# EAGLE schematic eclair-logical (EAGLE 6.6.0), part 1 of 2

## Sheet 1 of 10: MAR/MDR
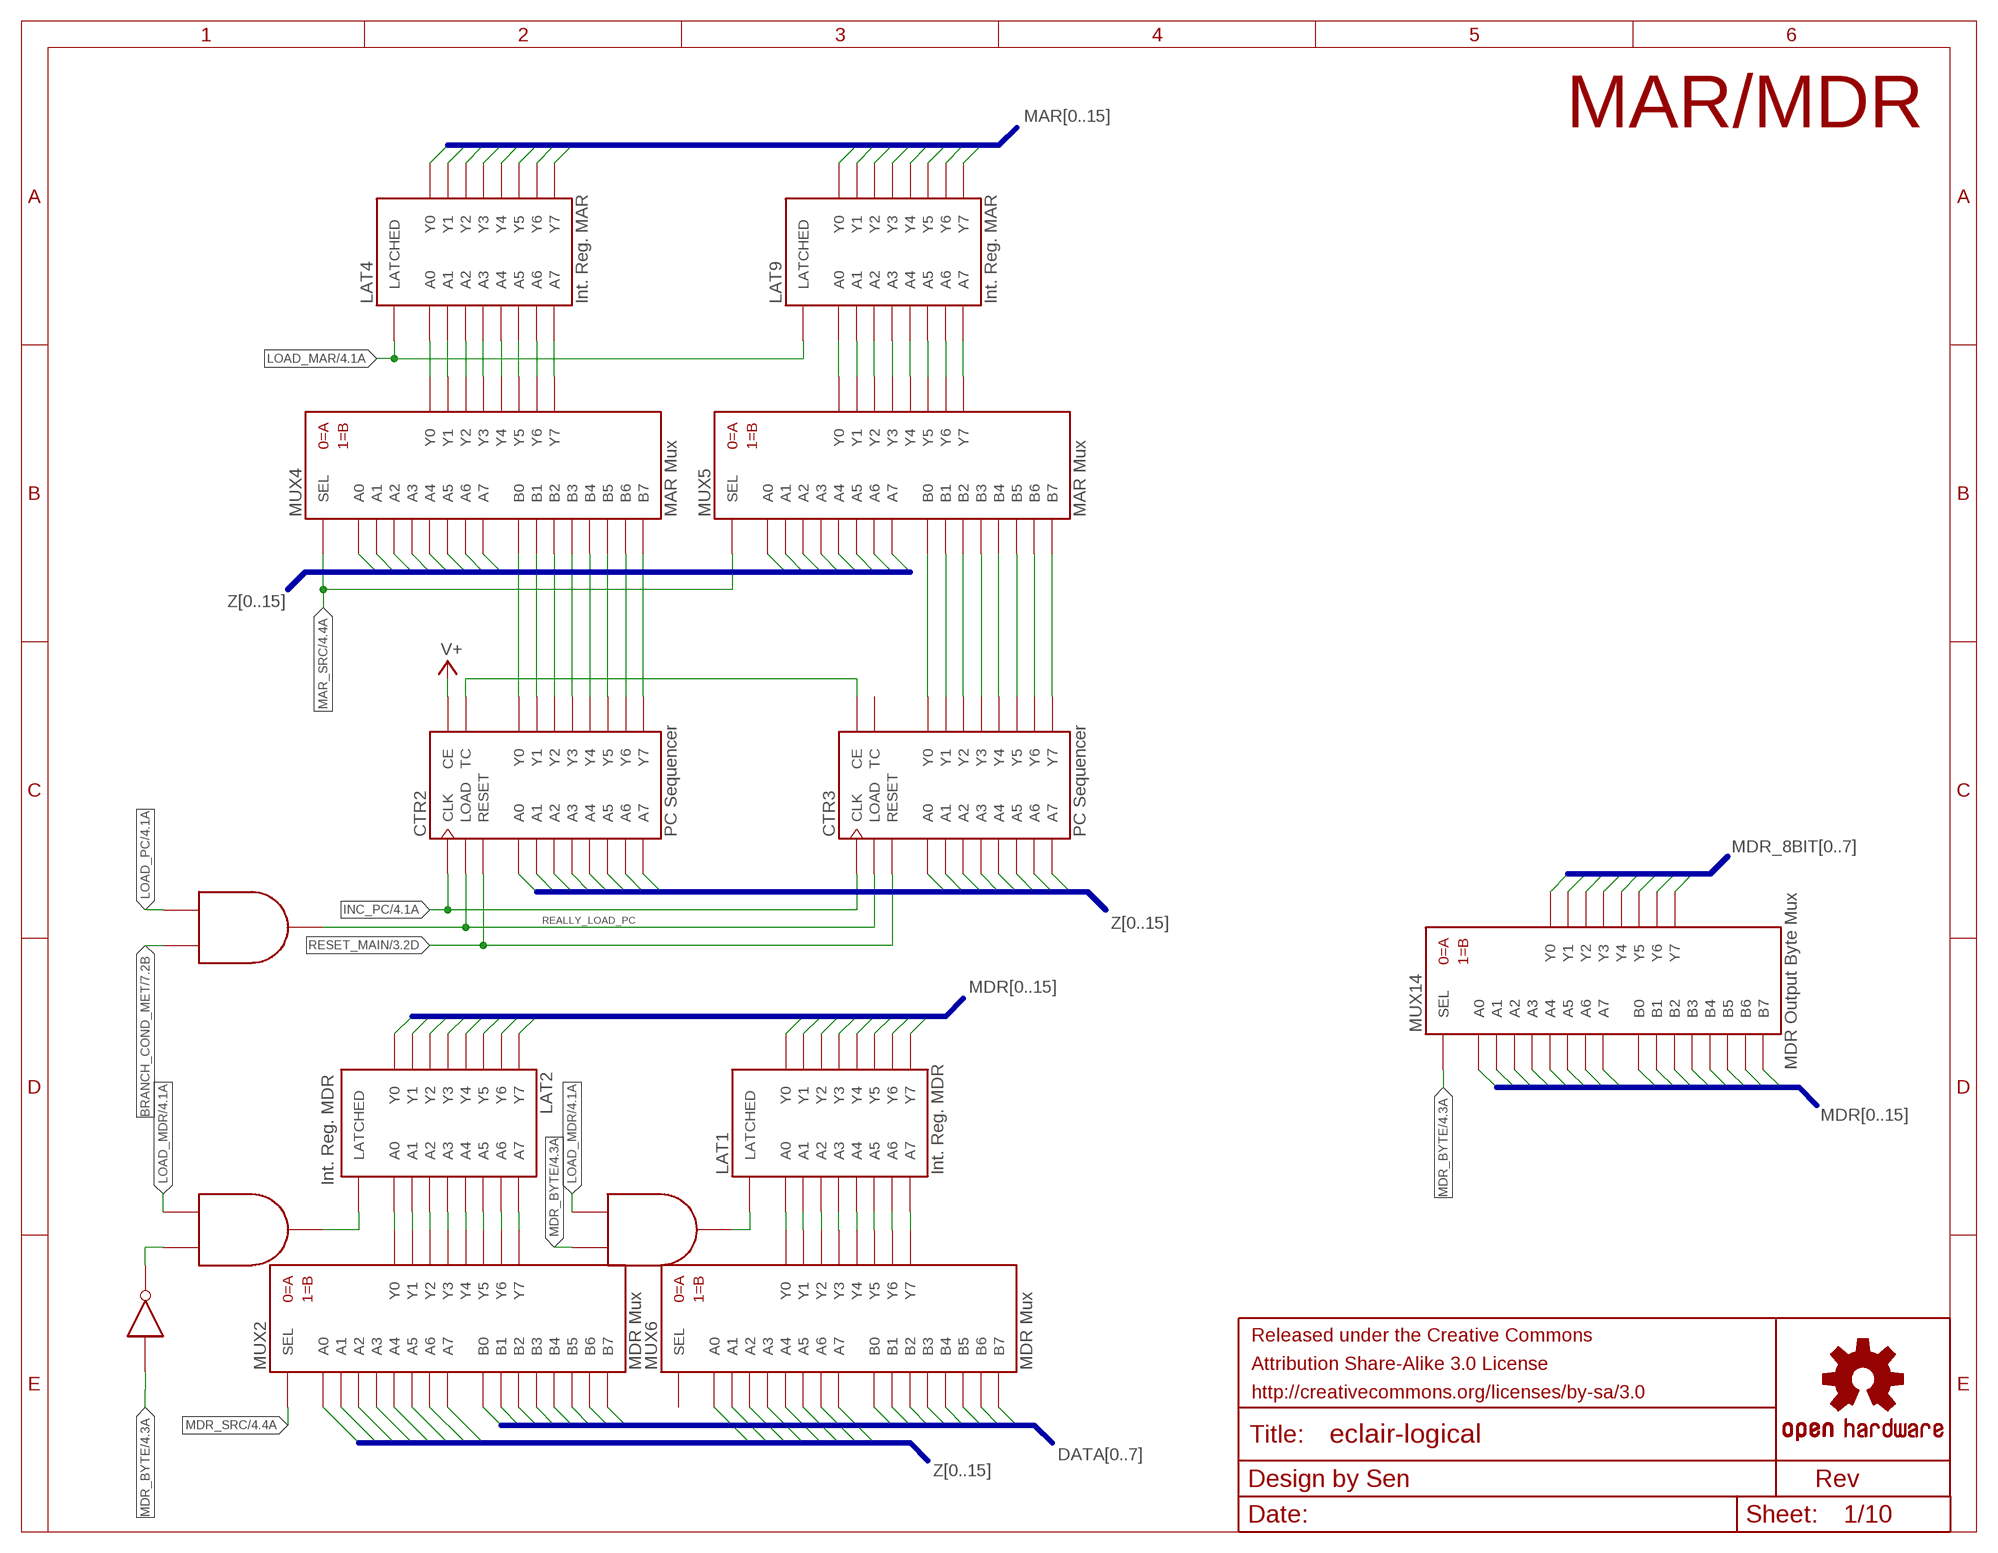
[diagram p0: schematic, sheet 1]

### Parts
AND11  AND-2  [NULL]
AND20  AND-2  [NULL]
AND21  AND-2  [NULL]
CTR2  PC Sequencer  COUNTER-8-LR  [NULL]
CTR3  PC Sequencer  COUNTER-8-LR  [NULL]
FRAME8  FRAME-LETTER-GRID-OSHW-SEN  [CC-BY-SA-3.0-LARGE]
LAT1  Int. Reg. MDR  LATCH-8  [NULL]
LAT2  Int. Reg. MDR  LATCH-8  [NULL]
LAT4  Int. Reg. MAR  LATCH-8  [NULL]
LAT9  Int. Reg. MAR  LATCH-8  [NULL]
MUX2  MDR Mux  MUX-2X8  [NULL]
MUX4  MAR Mux  MUX-2X8  [NULL]
MUX5  MAR Mux  MUX-2X8  [NULL]
MUX6  MDR Mux  MUX-2X8  [NULL]
MUX14  MDR Output Byte Mux  MUX-2X8  [NULL]
NOT3  NOT  [NULL]

### Nets
BRANCH_COND_MET: AND11.P$2(B) ; also sheet 7
DATA0: MUX2.P$9(B0) MUX6.P$9(B0) ; also sheet 5,8
DATA1: MUX2.P$10(B1) MUX6.P$10(B1) ; also sheet 5,8
DATA2: MUX2.P$11(B2) MUX6.P$11(B2) ; also sheet 5,8
DATA3: MUX2.P$12(B3) MUX6.P$12(B3) ; also sheet 5,8
DATA4: MUX2.P$13(B4) MUX6.P$13(B4) ; also sheet 5,8
DATA5: MUX2.P$14(B5) MUX6.P$14(B5) ; also sheet 5,8
DATA6: MUX2.P$15(B6) MUX6.P$15(B6) ; also sheet 5,8
DATA7: MUX2.P$16(B7) MUX6.P$16(B7) ; also sheet 5,8
INC_PC: CTR2.P$9(CLK) CTR3.P$9(CLK) ; also sheet 4
LOAD_MAR: LAT4.P$9(LATCHED) LAT9.P$9(LATCHED) ; also sheet 4
LOAD_MDR: AND20.P$1(A) AND21.P$1(A) ; also sheet 4
LOAD_MDR_H: AND21.P$3(Y) LAT1.P$9(LATCHED)
LOAD_MDR_L: AND20.P$3(Y) LAT2.P$9(LATCHED)
LOAD_PC: AND11.P$1(A) ; also sheet 4
MAR0: LAT4.P$10(Y0) ; also sheet 2,9
MAR1: LAT4.P$11(Y1) ; also sheet 2,9
MAR2: LAT4.P$12(Y2) ; also sheet 2,9
MAR3: LAT4.P$13(Y3) ; also sheet 2,9
MAR4: LAT4.P$14(Y4) ; also sheet 2
MAR5: LAT4.P$15(Y5) ; also sheet 2,9
MAR6: LAT4.P$16(Y6) ; also sheet 2,9
MAR7: LAT4.P$17(Y7) ; also sheet 2,9
MAR8: LAT9.P$10(Y0) ; also sheet 2,9
MAR9: LAT9.P$11(Y1) ; also sheet 2,9
MAR10: LAT9.P$12(Y2) ; also sheet 2,9
MAR11: LAT9.P$13(Y3) ; also sheet 2,9
MAR12: LAT9.P$14(Y4) ; also sheet 2,9
MAR13: LAT9.P$15(Y5) ; also sheet 2,9
MAR14: LAT9.P$16(Y6) ; also sheet 2,9
MAR15: LAT9.P$17(Y7) ; also sheet 2,9
MAR_SRC: MUX4.P$17(SEL) MUX5.P$17(SEL) ; also sheet 4
MDR0: LAT2.P$10(Y0) MUX14.P$1(A0) ; also sheet 2
MDR1: LAT2.P$11(Y1) MUX14.P$2(A1) ; also sheet 2
MDR2: LAT2.P$12(Y2) MUX14.P$3(A2) ; also sheet 2
MDR3: LAT2.P$13(Y3) MUX14.P$4(A3) ; also sheet 2
MDR4: LAT2.P$14(Y4) MUX14.P$5(A4) ; also sheet 2
MDR5: LAT2.P$15(Y5) MUX14.P$6(A5) ; also sheet 2
MDR6: LAT2.P$16(Y6) MUX14.P$7(A6) ; also sheet 2
MDR7: LAT2.P$17(Y7) MUX14.P$8(A7) ; also sheet 2
MDR8: LAT1.P$10(Y0) MUX14.P$9(B0) ; also sheet 2
MDR9: LAT1.P$11(Y1) MUX14.P$10(B1) ; also sheet 2
MDR10: LAT1.P$12(Y2) MUX14.P$11(B2) ; also sheet 2
MDR11: LAT1.P$13(Y3) MUX14.P$12(B3) ; also sheet 2
MDR12: LAT1.P$14(Y4) MUX14.P$13(B4) ; also sheet 2
MDR13: LAT1.P$15(Y5) MUX14.P$14(B5) ; also sheet 2
MDR14: LAT1.P$16(Y6) MUX14.P$15(B6) ; also sheet 2
MDR15: LAT1.P$17(Y7) MUX14.P$16(B7) ; also sheet 2
MDR_8BIT0: MUX14.P$18(Y0) ; also sheet 8
MDR_8BIT1: MUX14.P$19(Y1) ; also sheet 8
MDR_8BIT2: MUX14.P$20(Y2) ; also sheet 8
MDR_8BIT3: MUX14.P$21(Y3) ; also sheet 8
MDR_8BIT4: MUX14.P$22(Y4) ; also sheet 8
MDR_8BIT5: MUX14.P$23(Y5) ; also sheet 8
MDR_8BIT6: MUX14.P$24(Y6) ; also sheet 8
MDR_8BIT7: MUX14.P$25(Y7) ; also sheet 8
MDR_BYTE: AND21.P$2(B) MUX14.P$17(SEL) NOT3.P$1(Q) ; also sheet 4
MDR_LOW_BYTE: AND20.P$2(B) NOT3.P$2(Y)
MDR_SRC: MUX2.P$17(SEL) ; also sheet 4
N$9: LAT2.P$1(A0) MUX2.P$18(Y0)
N$18: LAT2.P$2(A1) MUX2.P$19(Y1)
N$19: LAT2.P$3(A2) MUX2.P$20(Y2)
N$20: LAT2.P$4(A3) MUX2.P$21(Y3)
N$21: LAT2.P$5(A4) MUX2.P$22(Y4)
N$22: LAT2.P$6(A5) MUX2.P$23(Y5)
N$23: LAT2.P$7(A6) MUX2.P$24(Y6)
N$24: LAT2.P$8(A7) MUX2.P$25(Y7)
N$98: LAT4.P$8(A7) MUX4.P$25(Y7)
N$99: LAT4.P$7(A6) MUX4.P$24(Y6)
N$100: LAT4.P$6(A5) MUX4.P$23(Y5)
N$101: LAT4.P$5(A4) MUX4.P$22(Y4)
N$102: LAT4.P$4(A3) MUX4.P$21(Y3)
N$103: LAT4.P$3(A2) MUX4.P$20(Y2)
N$104: LAT4.P$2(A1) MUX4.P$19(Y1)
N$105: LAT4.P$1(A0) MUX4.P$18(Y0)
N$106: LAT9.P$1(A0) MUX5.P$18(Y0)
N$107: LAT9.P$2(A1) MUX5.P$19(Y1)
N$108: LAT9.P$3(A2) MUX5.P$20(Y2)
N$109: LAT9.P$4(A3) MUX5.P$21(Y3)
N$110: LAT9.P$5(A4) MUX5.P$22(Y4)
N$111: LAT9.P$6(A5) MUX5.P$23(Y5)
N$112: LAT9.P$8(A7) MUX5.P$25(Y7)
N$113: LAT9.P$7(A6) MUX5.P$24(Y6)
N$114: CTR3.P$12(Y0) MUX5.P$9(B0)
N$115: CTR3.P$13(Y1) MUX5.P$10(B1)
N$116: CTR3.P$14(Y2) MUX5.P$11(B2)
N$117: CTR3.P$15(Y3) MUX5.P$12(B3)
N$118: CTR3.P$16(Y4) MUX5.P$13(B4)
N$119: CTR3.P$17(Y5) MUX5.P$14(B5)
N$120: CTR2.P$13(Y1) MUX4.P$10(B1)
N$121: CTR2.P$21(TC) CTR3.P$20(CE)
N$122: CTR3.P$18(Y6) MUX5.P$15(B6)
N$123: CTR3.P$19(Y7) MUX5.P$16(B7)
N$124: CTR2.P$12(Y0) MUX4.P$9(B0)
N$125: CTR2.P$14(Y2) MUX4.P$11(B2)
N$126: CTR2.P$15(Y3) MUX4.P$12(B3)
N$127: CTR2.P$16(Y4) MUX4.P$13(B4)
N$128: CTR2.P$17(Y5) MUX4.P$14(B5)
N$129: CTR2.P$18(Y6) MUX4.P$15(B6)
N$130: CTR2.P$19(Y7) MUX4.P$16(B7)
N$141: LAT1.P$1(A0) MUX6.P$18(Y0)
N$142: LAT1.P$2(A1) MUX6.P$19(Y1)
N$143: LAT1.P$3(A2) MUX6.P$20(Y2)
N$144: LAT1.P$4(A3) MUX6.P$21(Y3)
N$145: LAT1.P$5(A4) MUX6.P$22(Y4)
N$146: LAT1.P$6(A5) MUX6.P$23(Y5)
N$147: LAT1.P$7(A6) MUX6.P$24(Y6)
N$148: LAT1.P$8(A7) MUX6.P$25(Y7)
REALLY_LOAD_PC: AND11.P$3(Y) CTR2.P$10(LOAD) CTR3.P$10(LOAD)
RESET_MAIN: CTR2.P$11(RESET) CTR3.P$11(RESET) ; also sheet 3,5
V+: CTR2.P$20(CE) ; also sheet 4,5,7,10
Z0: CTR2.P$1(A0) MUX2.P$1(A0) MUX4.P$1(A0) ; also sheet 2,3,6,9,10
Z1: CTR2.P$2(A1) MUX2.P$2(A1) MUX4.P$2(A1) ; also sheet 2,3,6,9,10
Z2: CTR2.P$3(A2) MUX2.P$3(A2) MUX4.P$3(A2) ; also sheet 2,3,6,9,10
Z3: CTR2.P$4(A3) MUX2.P$4(A3) MUX4.P$4(A3) ; also sheet 2,3,6,9,10
Z4: CTR2.P$5(A4) MUX2.P$5(A4) MUX4.P$5(A4) ; also sheet 2,3,6,9,10
Z5: CTR2.P$6(A5) MUX2.P$6(A5) MUX4.P$6(A5) ; also sheet 2,3,6,9,10
Z6: CTR2.P$7(A6) MUX2.P$7(A6) MUX4.P$7(A6) ; also sheet 2,3,6,9,10
Z7: CTR2.P$8(A7) MUX2.P$8(A7) MUX4.P$8(A7) ; also sheet 2,3,6,9,10
Z8: CTR3.P$1(A0) MUX5.P$1(A0) MUX6.P$1(A0) ; also sheet 2,3,6,9
Z9: CTR3.P$2(A1) MUX5.P$2(A1) MUX6.P$2(A1) ; also sheet 2,3,6,9
Z10: CTR3.P$3(A2) MUX5.P$3(A2) MUX6.P$3(A2) ; also sheet 2,3,6,9
Z11: CTR3.P$4(A3) MUX5.P$4(A3) MUX6.P$4(A3) ; also sheet 2,3,6,9
Z12: CTR3.P$5(A4) MUX5.P$5(A4) MUX6.P$5(A4) ; also sheet 2,3,6,9
Z13: CTR3.P$6(A5) MUX5.P$6(A5) MUX6.P$6(A5) ; also sheet 2,3,6,9
Z14: CTR3.P$7(A6) MUX5.P$7(A6) MUX6.P$7(A6) ; also sheet 2,3,6,9
Z15: CTR3.P$8(A7) MUX5.P$8(A7) MUX6.P$8(A7) ; also sheet 2,3,6,9
Unconnected: CTR3.P$21(TC) MUX6.P$17(SEL)

### Buses
DATA[0..7]
MDR[0..15]
MAR[0..15]
Z[0..15]
MDR_8BIT[0..7]

### Notes on the sheet
- MAR/MDR

## Sheet 2 of 10: ALU
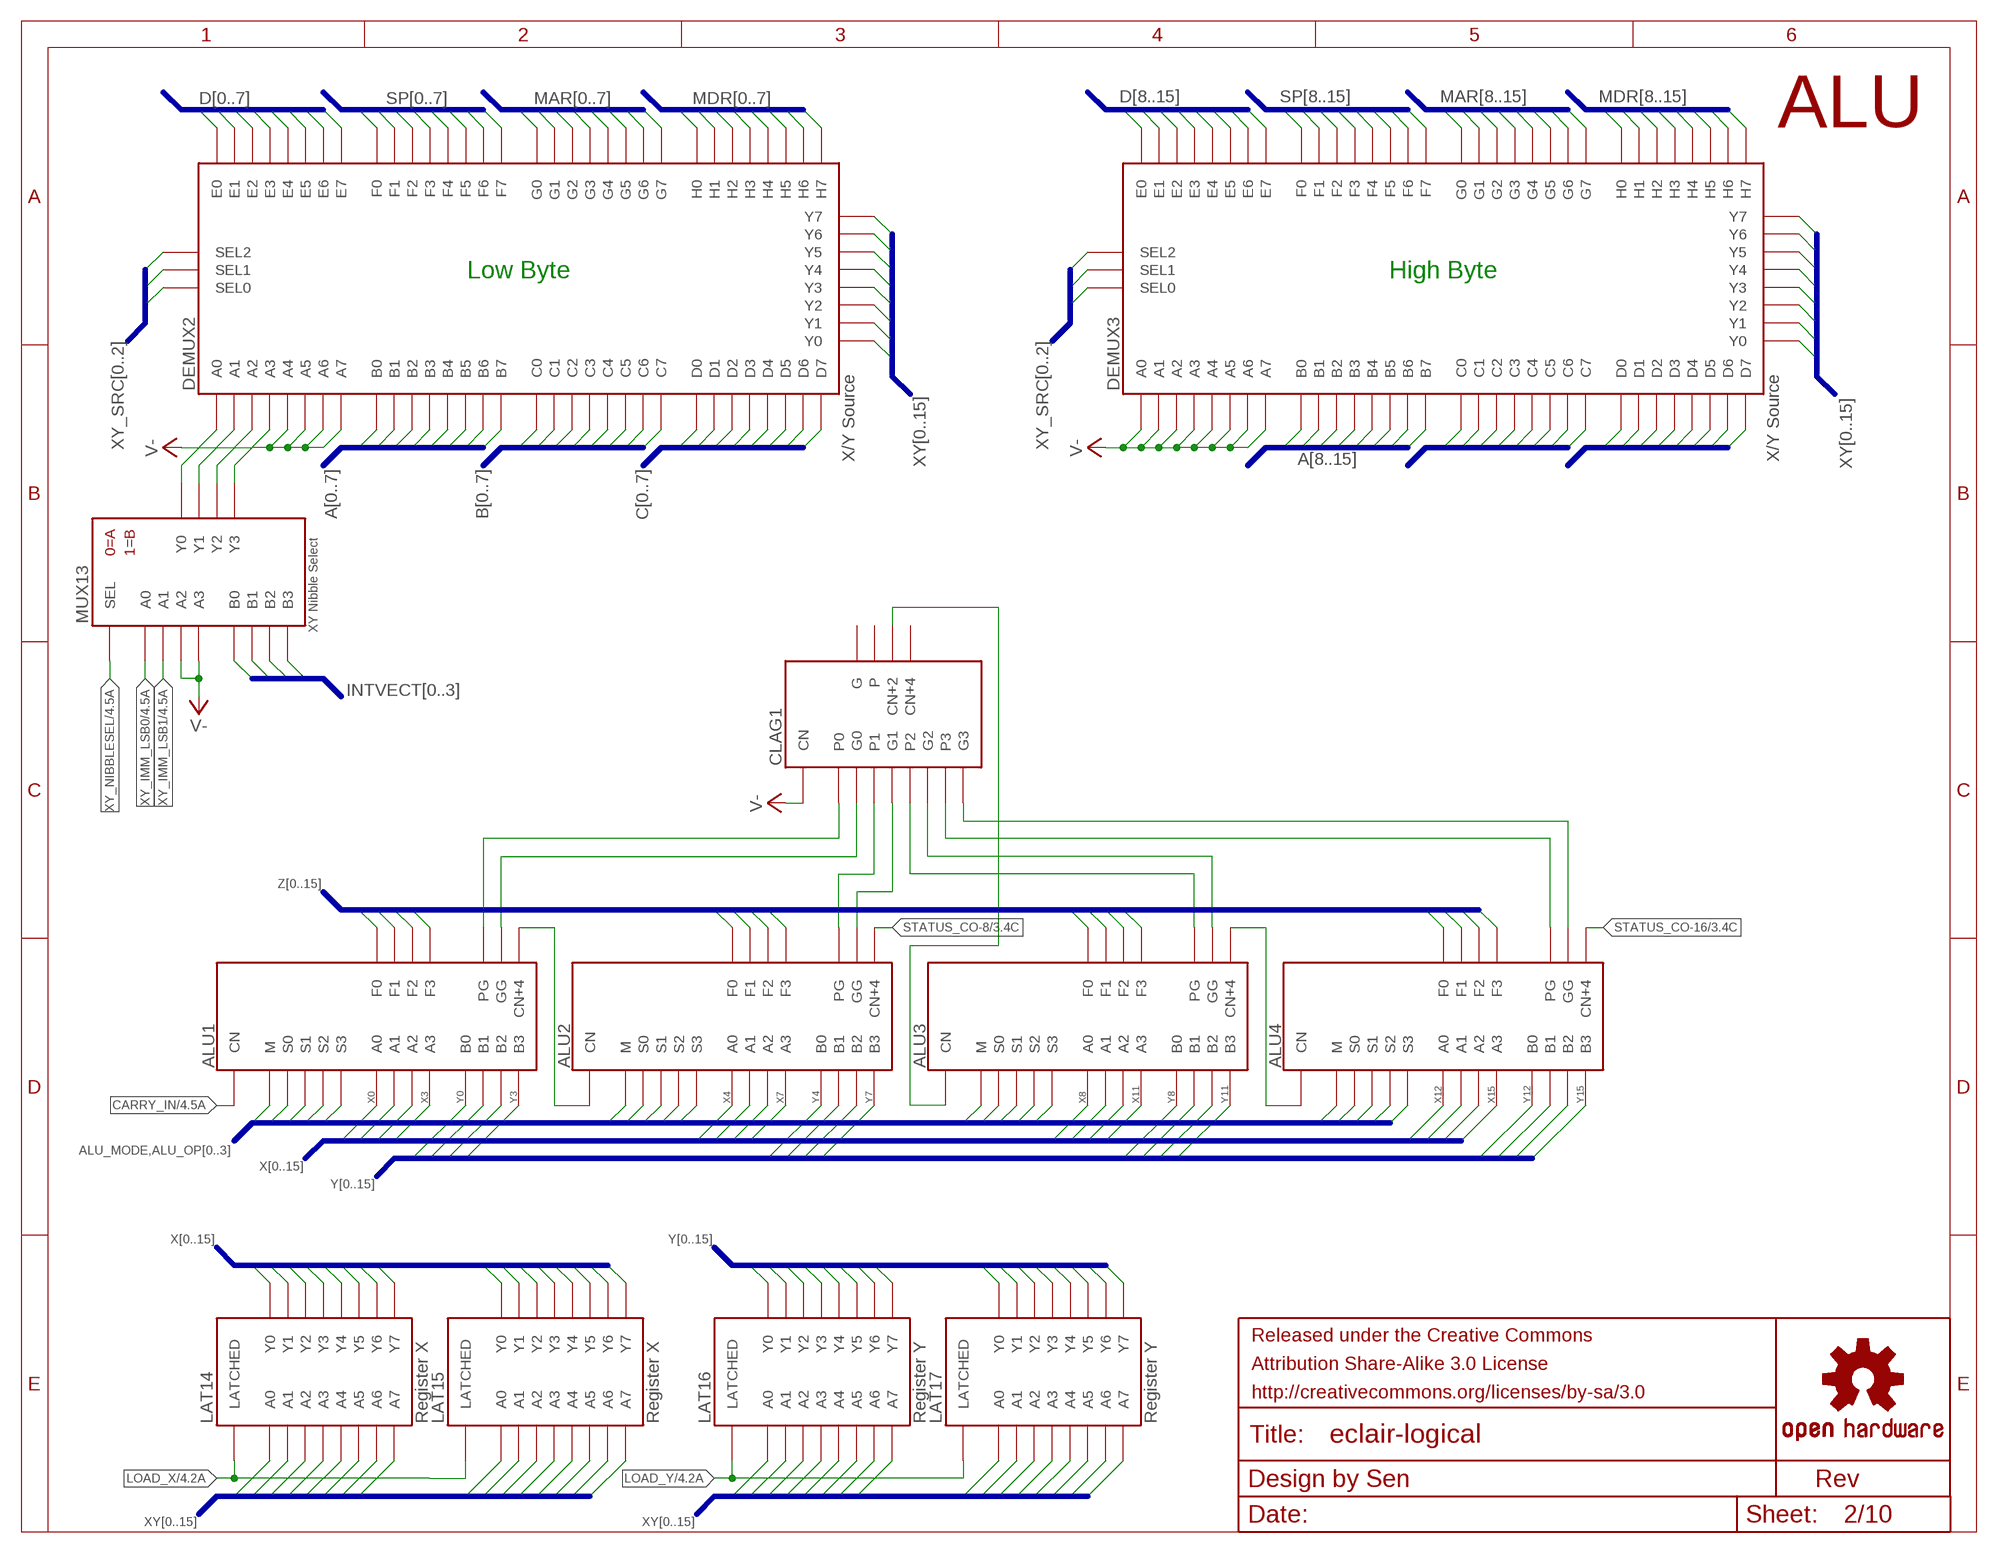
[diagram p1: schematic, sheet 2]

### Parts
ALU1  ALU-4  [NULL]
ALU2  ALU-4  [NULL]
ALU3  ALU-4  [NULL]
ALU4  ALU-4  [NULL]
CLAG1  CLAG-4  [NULL]
DEMUX2  X/Y Source  DEMUX-8X8  [NULL]
DEMUX3  X/Y Source  DEMUX-8X8  [NULL]
FRAME5  FRAME-LETTER-GRID-OSHW-SEN  [CC-BY-SA-3.0-LARGE]
LAT14  Register X  LATCH-8  [NULL]
LAT15  Register X  LATCH-8  [NULL]
LAT16  Register Y  LATCH-8  [NULL]
LAT17  Register Y  LATCH-8  [NULL]
MUX13  XY Nibble Select  MUX-2X4  [NULL]

### Nets
A0: DEMUX2.P$9(B0) ; also sheet 6
A1: DEMUX2.P$10(B1) ; also sheet 6
A2: DEMUX2.P$11(B2) ; also sheet 6
A3: DEMUX2.P$12(B3) ; also sheet 6
A4: DEMUX2.P$13(B4) ; also sheet 6
A5: DEMUX2.P$14(B5) ; also sheet 6
A6: DEMUX2.P$15(B6) ; also sheet 6
A7: DEMUX2.P$16(B7) ; also sheet 6
A8: DEMUX3.P$9(B0) ; also sheet 6
A9: DEMUX3.P$10(B1) ; also sheet 6
A10: DEMUX3.P$11(B2) ; also sheet 6
A11: DEMUX3.P$12(B3) ; also sheet 6
A12: DEMUX3.P$13(B4) ; also sheet 6
A13: DEMUX3.P$14(B5) ; also sheet 6
A14: DEMUX3.P$15(B6) ; also sheet 6
A15: DEMUX3.P$16(B7) ; also sheet 6
ALU_MODE: ALU1.P$16(M) ALU2.P$16(M) ALU3.P$16(M) ALU4.P$16(M) ; also sheet 4
ALU_OP0: ALU1.P$18(S0) ALU2.P$18(S0) ALU3.P$18(S0) ALU4.P$18(S0) ; also sheet 4
ALU_OP1: ALU1.P$19(S1) ALU2.P$19(S1) ALU3.P$19(S1) ALU4.P$19(S1) ; also sheet 4
ALU_OP2: ALU1.P$20(S2) ALU2.P$20(S2) ALU3.P$20(S2) ALU4.P$20(S2) ; also sheet 4
ALU_OP3: ALU1.P$21(S3) ALU2.P$21(S3) ALU3.P$21(S3) ALU4.P$21(S3) ; also sheet 4
B0: DEMUX2.P$17(C0) ; also sheet 6
B1: DEMUX2.P$18(C1) ; also sheet 6
B2: DEMUX2.P$19(C2) ; also sheet 6
B3: DEMUX2.P$20(C3) ; also sheet 6
B4: DEMUX2.P$21(C4) ; also sheet 6
B5: DEMUX2.P$22(C5) ; also sheet 6
B6: DEMUX2.P$23(C6) ; also sheet 6
B7: DEMUX2.P$24(C7) ; also sheet 6
B8: DEMUX3.P$17(C0) ; also sheet 6
B9: DEMUX3.P$18(C1) ; also sheet 6
B10: DEMUX3.P$19(C2) ; also sheet 6
B11: DEMUX3.P$20(C3) ; also sheet 6
B12: DEMUX3.P$21(C4) ; also sheet 6
B13: DEMUX3.P$22(C5) ; also sheet 6
B14: DEMUX3.P$23(C6) ; also sheet 6
B15: DEMUX3.P$24(C7) ; also sheet 6
C0: DEMUX2.P$25(D0) ; also sheet 6
C1: DEMUX2.P$26(D1) ; also sheet 6
C2: DEMUX2.P$27(D2) ; also sheet 6
C3: DEMUX2.P$28(D3) ; also sheet 6
C4: DEMUX2.P$29(D4) ; also sheet 6
C5: DEMUX2.P$30(D5) ; also sheet 6
C6: DEMUX2.P$31(D6) ; also sheet 6
C7: DEMUX2.P$32(D7) ; also sheet 6
C8: DEMUX3.P$25(D0) ; also sheet 6
C9: DEMUX3.P$26(D1) ; also sheet 6
C10: DEMUX3.P$27(D2) ; also sheet 6
C11: DEMUX3.P$28(D3) ; also sheet 6
C12: DEMUX3.P$29(D4) ; also sheet 6
C13: DEMUX3.P$30(D5) ; also sheet 6
C14: DEMUX3.P$31(D6) ; also sheet 6
C15: DEMUX3.P$32(D7) ; also sheet 6
CARRY_IN: ALU1.P$9(CN) ; also sheet 4
D0: DEMUX2.P$33(E0) ; also sheet 6
D1: DEMUX2.P$34(E1) ; also sheet 6
D2: DEMUX2.P$35(E2) ; also sheet 6
D3: DEMUX2.P$36(E3) ; also sheet 6
D4: DEMUX2.P$37(E4) ; also sheet 6
D5: DEMUX2.P$38(E5) ; also sheet 6
D6: DEMUX2.P$39(E6) ; also sheet 6
D7: DEMUX2.P$40(E7) ; also sheet 6
D8: DEMUX3.P$33(E0) ; also sheet 6
D9: DEMUX3.P$34(E1) ; also sheet 6
D10: DEMUX3.P$35(E2) ; also sheet 6
D11: DEMUX3.P$36(E3) ; also sheet 6
D12: DEMUX3.P$37(E4) ; also sheet 6
D13: DEMUX3.P$38(E5) ; also sheet 6
D14: DEMUX3.P$39(E6) ; also sheet 6
D15: DEMUX3.P$40(E7) ; also sheet 6
INTVECT0: MUX13.P$5(B0) ; also sheet 10
INTVECT1: MUX13.P$6(B1) ; also sheet 10
INTVECT2: MUX13.P$7(B2) ; also sheet 10
INTVECT3: MUX13.P$8(B3) ; also sheet 10
LOAD_X: LAT14.P$9(LATCHED) LAT15.P$9(LATCHED) ; also sheet 4
LOAD_Y: LAT16.P$9(LATCHED) LAT17.P$9(LATCHED) ; also sheet 4
MAR0: DEMUX2.P$49(G0) ; also sheet 1,9
MAR1: DEMUX2.P$50(G1) ; also sheet 1,9
MAR2: DEMUX2.P$51(G2) ; also sheet 1,9
MAR3: DEMUX2.P$52(G3) ; also sheet 1,9
MAR4: DEMUX2.P$53(G4) ; also sheet 1
MAR5: DEMUX2.P$54(G5) ; also sheet 1,9
MAR6: DEMUX2.P$55(G6) ; also sheet 1,9
MAR7: DEMUX2.P$56(G7) ; also sheet 1,9
MAR8: DEMUX3.P$49(G0) ; also sheet 1,9
MAR9: DEMUX3.P$50(G1) ; also sheet 1,9
MAR10: DEMUX3.P$51(G2) ; also sheet 1,9
MAR11: DEMUX3.P$52(G3) ; also sheet 1,9
MAR12: DEMUX3.P$53(G4) ; also sheet 1,9
MAR13: DEMUX3.P$54(G5) ; also sheet 1,9
MAR14: DEMUX3.P$55(G6) ; also sheet 1,9
MAR15: DEMUX3.P$56(G7) ; also sheet 1,9
MDR0: DEMUX2.P$57(H0) ; also sheet 1
MDR1: DEMUX2.P$58(H1) ; also sheet 1
MDR2: DEMUX2.P$59(H2) ; also sheet 1
MDR3: DEMUX2.P$60(H3) ; also sheet 1
MDR4: DEMUX2.P$61(H4) ; also sheet 1
MDR5: DEMUX2.P$62(H5) ; also sheet 1
MDR6: DEMUX2.P$63(H6) ; also sheet 1
MDR7: DEMUX2.P$64(H7) ; also sheet 1
MDR8: DEMUX3.P$57(H0) ; also sheet 1
MDR9: DEMUX3.P$58(H1) ; also sheet 1
MDR10: DEMUX3.P$59(H2) ; also sheet 1
MDR11: DEMUX3.P$60(H3) ; also sheet 1
MDR12: DEMUX3.P$61(H4) ; also sheet 1
MDR13: DEMUX3.P$62(H5) ; also sheet 1
MDR14: DEMUX3.P$63(H6) ; also sheet 1
MDR15: DEMUX3.P$64(H7) ; also sheet 1
N$96: ALU1.P$10(CN+4) ALU2.P$9(CN)
N$131: ALU3.P$10(CN+4) ALU4.P$9(CN)
N$132: ALU1.P$17(PG) CLAG1.P$10(P0)
N$133: ALU1.P$15(GG) CLAG1.P$5(G0)
N$134: ALU2.P$17(PG) CLAG1.P$11(P1)
N$135: ALU2.P$15(GG) CLAG1.P$6(G1)
N$136: ALU4.P$15(GG) CLAG1.P$8(G3)
N$137: ALU4.P$17(PG) CLAG1.P$13(P3)
N$138: ALU3.P$15(GG) CLAG1.P$7(G2)
N$139: ALU3.P$17(PG) CLAG1.P$12(P2)
N$140: ALU3.P$9(CN) CLAG1.P$2(CN+2)
SP0: DEMUX2.P$41(F0) ; also sheet 6
SP1: DEMUX2.P$42(F1) ; also sheet 6
SP2: DEMUX2.P$43(F2) ; also sheet 6
SP3: DEMUX2.P$44(F3) ; also sheet 6
SP4: DEMUX2.P$45(F4) ; also sheet 6
SP5: DEMUX2.P$46(F5) ; also sheet 6
SP6: DEMUX2.P$47(F6) ; also sheet 6
SP7: DEMUX2.P$48(F7) ; also sheet 6
SP8: DEMUX3.P$41(F0) ; also sheet 6
SP9: DEMUX3.P$42(F1) ; also sheet 6
SP10: DEMUX3.P$43(F2) ; also sheet 6
SP11: DEMUX3.P$44(F3) ; also sheet 6
SP12: DEMUX3.P$45(F4) ; also sheet 6
SP13: DEMUX3.P$46(F5) ; also sheet 6
SP14: DEMUX3.P$47(F6) ; also sheet 6
SP15: DEMUX3.P$48(F7) ; also sheet 6
STATUS_CO-8: ALU2.P$10(CN+4) ; also sheet 3
STATUS_CO-16: ALU4.P$10(CN+4) ; also sheet 3
V-: CLAG1.P$1(CN) DEMUX2.P$5(A4) DEMUX2.P$6(A5) DEMUX2.P$7(A6) DEMUX2.P$8(A7) DEMUX3.P$1(A0) DEMUX3.P$2(A1) DEMUX3.P$3(A2) DEMUX3.P$4(A3) DEMUX3.P$5(A4) DEMUX3.P$6(A5) DEMUX3.P$7(A6) DEMUX3.P$8(A7) MUX13.P$3(A2) MUX13.P$4(A3) ; also sheet 5,9,10
X0: ALU1.P$1(A0) LAT14.P$10(Y0)
X1: ALU1.P$2(A1) LAT14.P$11(Y1)
X2: ALU1.P$3(A2) LAT14.P$12(Y2)
X3: ALU1.P$4(A3) LAT14.P$13(Y3)
X4: ALU2.P$1(A0) LAT14.P$14(Y4)
X5: ALU2.P$2(A1) LAT14.P$15(Y5)
X6: ALU2.P$3(A2) LAT14.P$16(Y6)
X7: ALU2.P$4(A3) LAT14.P$17(Y7)
X8: ALU3.P$1(A0) LAT15.P$10(Y0)
X9: ALU3.P$2(A1) LAT15.P$11(Y1)
X10: ALU3.P$3(A2) LAT15.P$12(Y2)
X11: ALU3.P$4(A3) LAT15.P$13(Y3)
X12: ALU4.P$1(A0) LAT15.P$14(Y4)
X13: ALU4.P$2(A1) LAT15.P$15(Y5)
X14: ALU4.P$3(A2) LAT15.P$16(Y6)
X15: ALU4.P$4(A3) LAT15.P$17(Y7)
XY0: DEMUX2.P$68(Y0) LAT14.P$1(A0) LAT16.P$1(A0)
XY1: DEMUX2.P$69(Y1) LAT14.P$2(A1) LAT16.P$2(A1)
XY2: DEMUX2.P$70(Y2) LAT14.P$3(A2) LAT16.P$3(A2)
XY3: DEMUX2.P$71(Y3) LAT14.P$4(A3) LAT16.P$4(A3)
XY4: DEMUX2.P$72(Y4) LAT14.P$5(A4) LAT16.P$5(A4)
XY5: DEMUX2.P$73(Y5) LAT14.P$6(A5) LAT16.P$6(A5)
XY6: DEMUX2.P$74(Y6) LAT14.P$7(A6) LAT16.P$7(A6)
XY7: DEMUX2.P$75(Y7) LAT14.P$8(A7) LAT16.P$8(A7)
XY8: DEMUX3.P$68(Y0) LAT15.P$1(A0) LAT17.P$1(A0)
XY9: DEMUX3.P$69(Y1) LAT15.P$2(A1) LAT17.P$2(A1)
XY10: DEMUX3.P$70(Y2) LAT15.P$3(A2) LAT17.P$3(A2)
XY11: DEMUX3.P$71(Y3) LAT15.P$4(A3) LAT17.P$4(A3)
XY12: DEMUX3.P$72(Y4) LAT15.P$5(A4) LAT17.P$5(A4)
XY13: DEMUX3.P$73(Y5) LAT15.P$6(A5) LAT17.P$6(A5)
XY14: DEMUX3.P$74(Y6) LAT15.P$7(A6) LAT17.P$7(A6)
XY15: DEMUX3.P$75(Y7) LAT15.P$8(A7) LAT17.P$8(A7)
XY_IMM_LSB0: MUX13.P$1(A0) ; also sheet 4
XY_IMM_LSB1: MUX13.P$2(A1) ; also sheet 4
XY_NIBBLE0: DEMUX2.P$1(A0) MUX13.P$10(Y0)
XY_NIBBLE1: DEMUX2.P$2(A1) MUX13.P$11(Y1)
XY_NIBBLE2: DEMUX2.P$3(A2) MUX13.P$12(Y2)
XY_NIBBLE3: DEMUX2.P$4(A3) MUX13.P$13(Y3)
XY_NIBBLESEL: MUX13.P$9(SEL) ; also sheet 4
XY_SRC0: DEMUX2.P$65(SEL0) DEMUX3.P$65(SEL0) ; also sheet 4
XY_SRC1: DEMUX2.P$66(SEL1) DEMUX3.P$66(SEL1) ; also sheet 4
XY_SRC2: DEMUX2.P$67(SEL2) DEMUX3.P$67(SEL2) ; also sheet 4
Y0: ALU1.P$5(B0) LAT16.P$10(Y0)
Y1: ALU1.P$6(B1) LAT16.P$11(Y1)
Y2: ALU1.P$7(B2) LAT16.P$12(Y2)
Y3: ALU1.P$8(B3) LAT16.P$13(Y3)
Y4: ALU2.P$5(B0) LAT16.P$14(Y4)
Y5: ALU2.P$6(B1) LAT16.P$15(Y5)
Y6: ALU2.P$7(B2) LAT16.P$16(Y6)
Y7: ALU2.P$8(B3) LAT16.P$17(Y7)
Y8: ALU3.P$5(B0) LAT17.P$10(Y0)
Y9: ALU3.P$6(B1) LAT17.P$11(Y1)
Y10: ALU3.P$7(B2) LAT17.P$12(Y2)
Y11: ALU3.P$8(B3) LAT17.P$13(Y3)
Y12: ALU4.P$5(B0) LAT17.P$14(Y4)
Y13: ALU4.P$6(B1) LAT17.P$15(Y5)
Y14: ALU4.P$7(B2) LAT17.P$16(Y6)
Y15: ALU4.P$8(B3) LAT17.P$17(Y7)
Z0: ALU1.P$11(F0) ; also sheet 1,3,6,9,10
Z1: ALU1.P$12(F1) ; also sheet 1,3,6,9,10
Z2: ALU1.P$13(F2) ; also sheet 1,3,6,9,10
Z3: ALU1.P$14(F3) ; also sheet 1,3,6,9,10
Z4: ALU2.P$11(F0) ; also sheet 1,3,6,9,10
Z5: ALU2.P$12(F1) ; also sheet 1,3,6,9,10
Z6: ALU2.P$13(F2) ; also sheet 1,3,6,9,10
Z7: ALU2.P$14(F3) ; also sheet 1,3,6,9,10
Z8: ALU3.P$11(F0) ; also sheet 1,3,6,9
Z9: ALU3.P$12(F1) ; also sheet 1,3,6,9
Z10: ALU3.P$13(F2) ; also sheet 1,3,6,9
Z11: ALU3.P$14(F3) ; also sheet 1,3,6,9
Z12: ALU4.P$11(F0) ; also sheet 1,3,6,9
Z13: ALU4.P$12(F1) ; also sheet 1,3,6,9
Z14: ALU4.P$13(F2) ; also sheet 1,3,6,9
Z15: ALU4.P$14(F3) ; also sheet 1,3,6,9
Unconnected: CLAG1.P$3(CN+4) CLAG1.P$4(G) CLAG1.P$9(P)

### Buses
ALU_MODE,ALU_OP[0..3]
X[0..15]
XY[0..15]
Y[0..15]
Z[0..15]
MDR[0..7]
A[0..7]
A[8..15]
B[0..7]
C[0..7]
D[0..7]
SP[0..7]
MAR[0..7]
XY_SRC[0..2]
D[8..15]
SP[8..15]
MAR[8..15]
MDR[8..15]
B[8..15]
C[8..15]
INTVECT[0..3]

### Notes on the sheet
- ALU
- Low Byte | High Byte

## Sheet 3 of 10: Clocks/Flags/Status
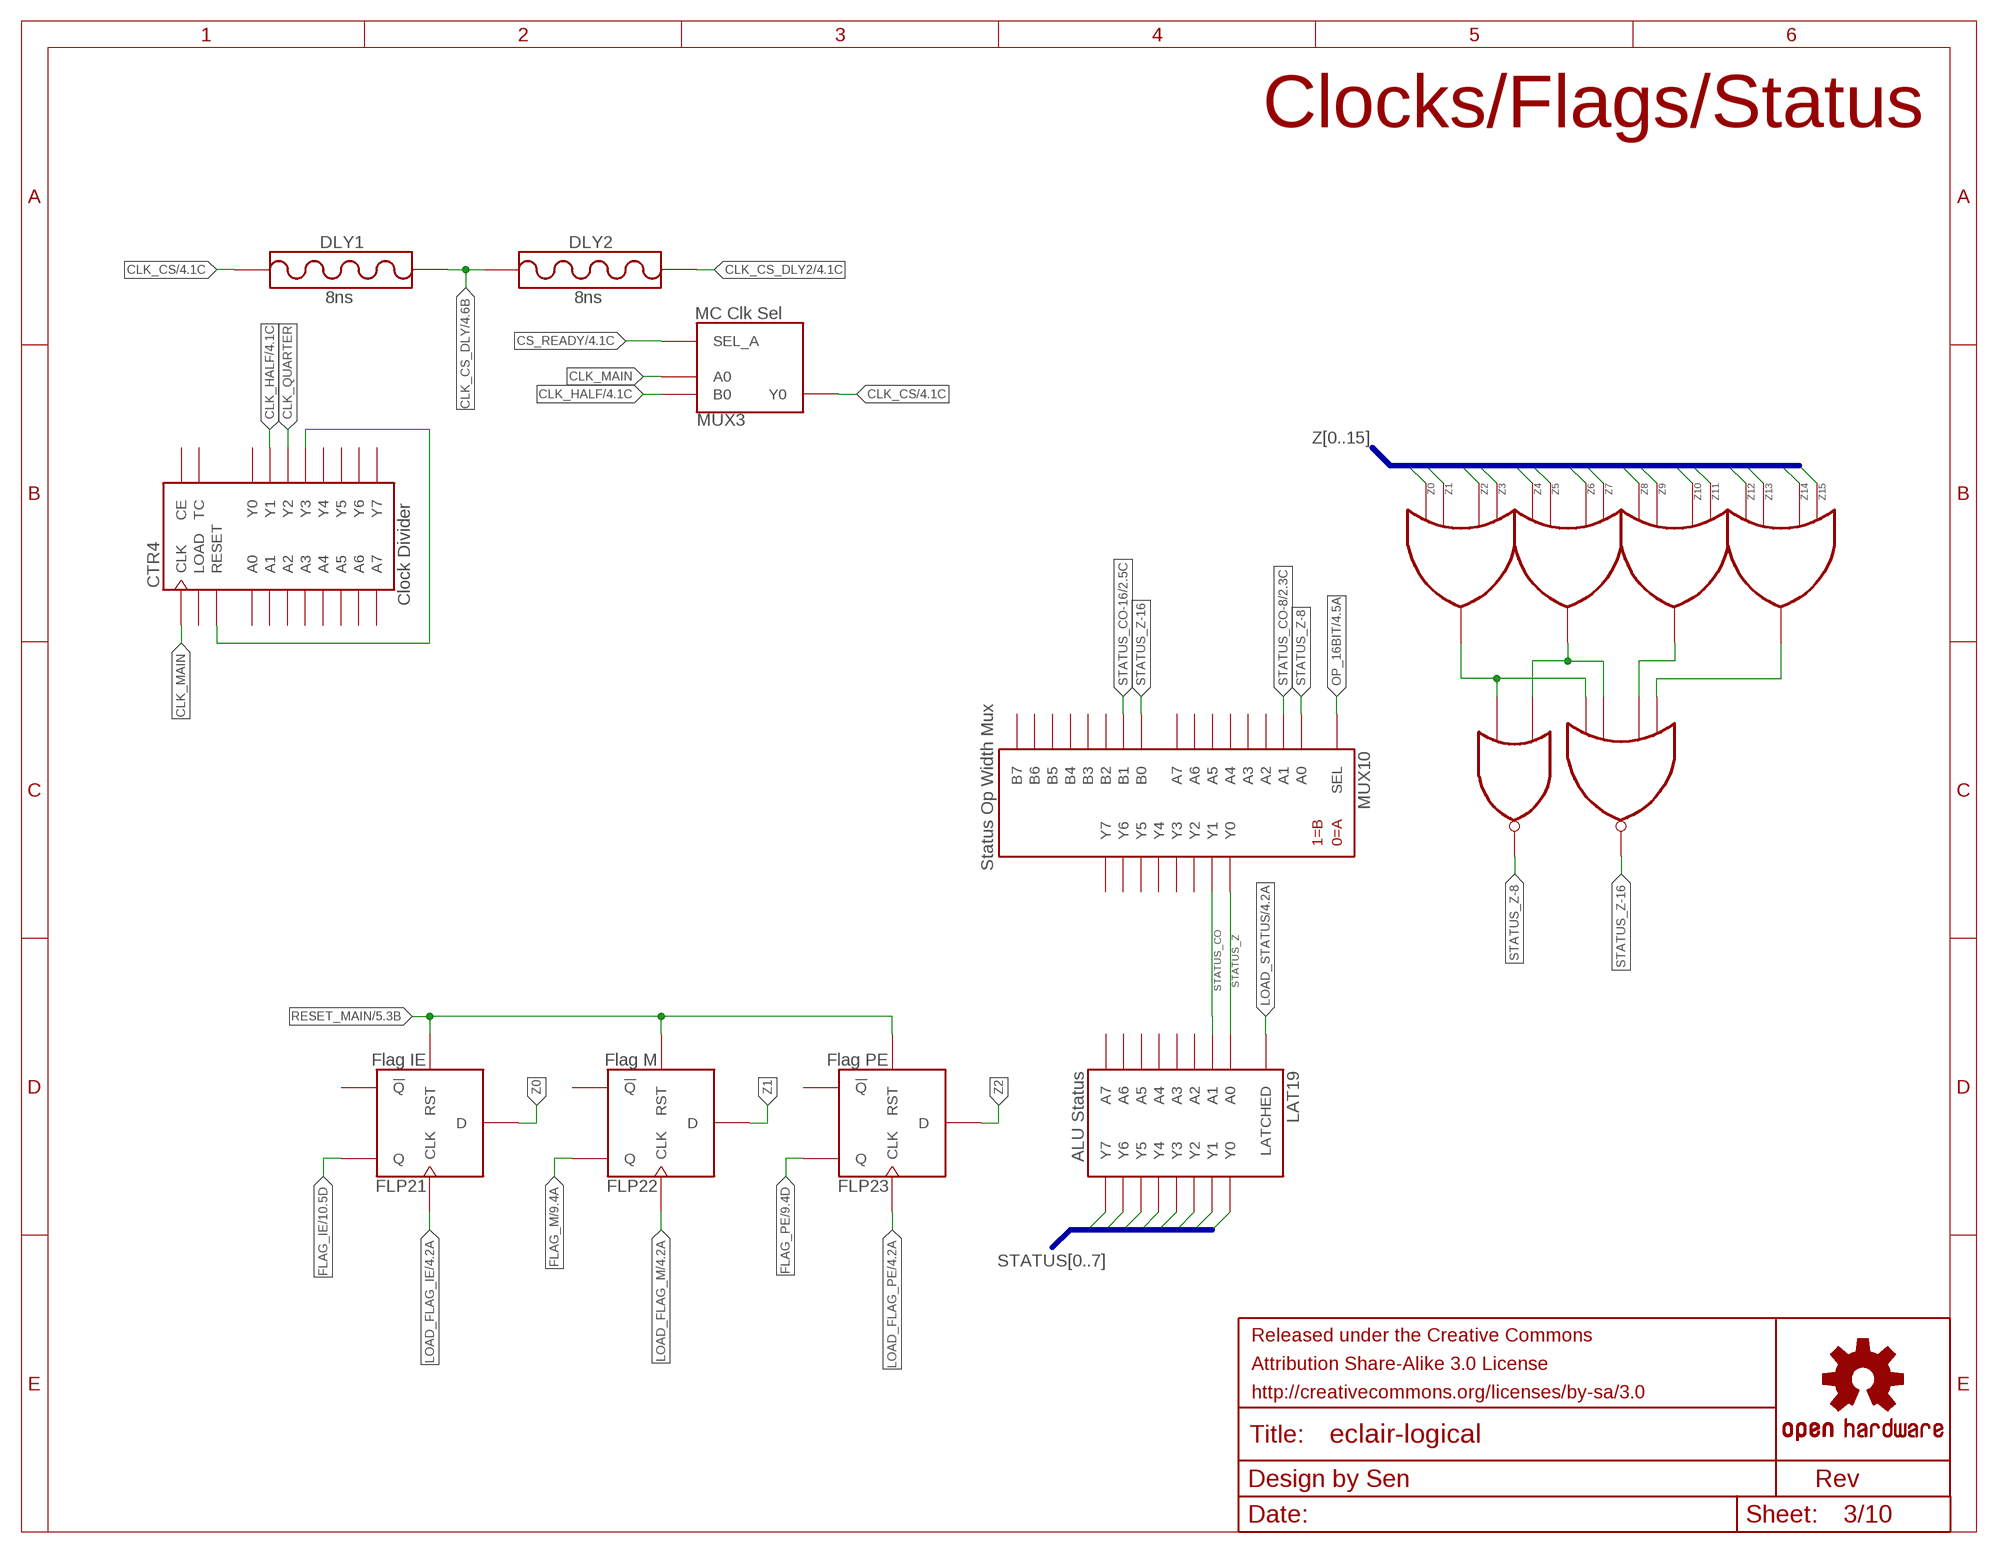
[diagram p2: schematic, sheet 3]

### Parts
CTR4  Clock Divider  COUNTER-8-LR  [NULL]
DLY1  8ns  DELAY  [NULL]
DLY2  8ns  DELAY  [NULL]
FLP21  Flag IE  FLIPFLOP-D-1  [NULL]
FLP22  Flag M  FLIPFLOP-D-1  [NULL]
FLP23  Flag PE  FLIPFLOP-D-1  [NULL]
FRAME1  FRAME-LETTER-GRID-OSHW-SEN  [CC-BY-SA-3.0-LARGE]
LAT19  ALU Status  LATCH-8  [NULL]
MUX3  MC Clk Sel  MUX-2X1  [NULL]
MUX10  Status Op Width Mux  MUX-2X8  [NULL]
NOR6  NOR-4  [NULL]
NOR7  NOR-2  [NULL]
OR5  OR-4  [NULL]
OR6  OR-4  [NULL]
OR7  OR-4  [NULL]
OR8  OR-4  [NULL]

### Nets
CLK_CS: DLY1.P$1(A) MUX3.P$4(Y0) ; also sheet 4,5
CLK_CS_DLY: DLY1.P$2(Q) DLY2.P$1(A) ; also sheet 4
CLK_CS_DLY2: DLY2.P$2(Q) ; also sheet 4
CLK_HALF: CTR4.P$13(Y1) MUX3.P$2(B0) ; also sheet 4
CLK_MAIN: CTR4.P$9(CLK) MUX3.P$1(A0)
CLK_QUARTER: CTR4.P$14(Y2)
CS_READY: MUX3.P$3(SEL_A) ; also sheet 4,5,9
FLAG_IE: FLP21.P$4(Q) ; also sheet 10
FLAG_M: FLP22.P$4(Q) ; also sheet 9
FLAG_PE: FLP23.P$4(Q) ; also sheet 9
LOAD_FLAG_IE: FLP21.P$2(CLK) ; also sheet 4
LOAD_FLAG_M: FLP22.P$2(CLK) ; also sheet 4
LOAD_FLAG_PE: FLP23.P$2(CLK) ; also sheet 4
LOAD_STATUS: LAT19.P$9(LATCHED) ; also sheet 4
N$156: CTR4.P$11(RESET) CTR4.P$15(Y3)
N$160: NOR6.P$3(C) NOR7.P$1(A) OR6.P$5(Y)
N$164: NOR6.P$2(B) OR7.P$5(Y)
N$171: NOR6.P$1(A) OR8.P$5(Y)
N$172: NOR6.P$4(D) NOR7.P$2(B) OR5.P$5(Y)
OP_16BIT: MUX10.P$17(SEL) ; also sheet 4,6
RESET_MAIN: FLP21.P$5(RST) FLP22.P$5(RST) FLP23.P$5(RST) ; also sheet 1,5
STATUS0: LAT19.P$10(Y0)
STATUS1: LAT19.P$11(Y1)
STATUS2: LAT19.P$12(Y2)
STATUS3: LAT19.P$13(Y3)
STATUS4: LAT19.P$14(Y4)
STATUS5: LAT19.P$15(Y5)
STATUS6: LAT19.P$16(Y6)
STATUS7: LAT19.P$17(Y7)
STATUS_CO: LAT19.P$2(A1) MUX10.P$19(Y1) ; also sheet 7
STATUS_CO-8: MUX10.P$2(A1) ; also sheet 2
STATUS_CO-16: MUX10.P$10(B1) ; also sheet 2
STATUS_Z: LAT19.P$1(A0) MUX10.P$18(Y0) ; also sheet 7
STATUS_Z-8: MUX10.P$1(A0) NOR7.P$3(Y)
STATUS_Z-16: MUX10.P$9(B0) NOR6.P$5(Y)
Z0: FLP21.P$3(D) OR5.P$4(D) ; also sheet 1,2,6,9,10
Z1: FLP22.P$3(D) OR5.P$3(C) ; also sheet 1,2,6,9,10
Z2: FLP23.P$3(D) OR5.P$2(B) ; also sheet 1,2,6,9,10
Z3: OR5.P$1(A) ; also sheet 1,2,6,9,10
Z4: OR6.P$4(D) ; also sheet 1,2,6,9,10
Z5: OR6.P$3(C) ; also sheet 1,2,6,9,10
Z6: OR6.P$2(B) ; also sheet 1,2,6,9,10
Z7: OR6.P$1(A) ; also sheet 1,2,6,9,10
Z8: OR7.P$4(D) ; also sheet 1,2,6,9
Z9: OR7.P$3(C) ; also sheet 1,2,6,9
Z10: OR7.P$2(B) ; also sheet 1,2,6,9
Z11: OR7.P$1(A) ; also sheet 1,2,6,9
Z12: OR8.P$4(D) ; also sheet 1,2,6,9
Z13: OR8.P$3(C) ; also sheet 1,2,6,9
Z14: OR8.P$2(B) ; also sheet 1,2,6,9
Z15: OR8.P$1(A) ; also sheet 1,2,6,9
Unconnected: CTR4.P$1(A0) CTR4.P$2(A1) CTR4.P$3(A2) CTR4.P$4(A3) CTR4.P$5(A4) CTR4.P$6(A5) CTR4.P$7(A6) CTR4.P$8(A7) CTR4.P$10(LOAD) CTR4.P$12(Y0) CTR4.P$16(Y4) CTR4.P$17(Y5) CTR4.P$18(Y6) CTR4.P$19(Y7) CTR4.P$20(CE) CTR4.P$21(TC) FLP21.P$1(!Q) FLP22.P$1(!Q) FLP23.P$1(!Q) LAT19.P$3(A2) LAT19.P$4(A3) LAT19.P$5(A4) LAT19.P$6(A5) LAT19.P$7(A6) LAT19.P$8(A7) MUX10.P$3(A2) MUX10.P$4(A3) MUX10.P$5(A4) MUX10.P$6(A5) MUX10.P$7(A6) MUX10.P$8(A7) MUX10.P$11(B2) MUX10.P$12(B3) MUX10.P$13(B4) MUX10.P$14(B5) MUX10.P$15(B6) MUX10.P$16(B7) MUX10.P$20(Y2) MUX10.P$21(Y3) MUX10.P$22(Y4) MUX10.P$23(Y5) MUX10.P$24(Y6) MUX10.P$25(Y7)

### Buses
Z[0..15]
STATUS[0..7]

### Notes on the sheet
- Clocks/Flags/Status

## Sheet 4 of 10: Microcode
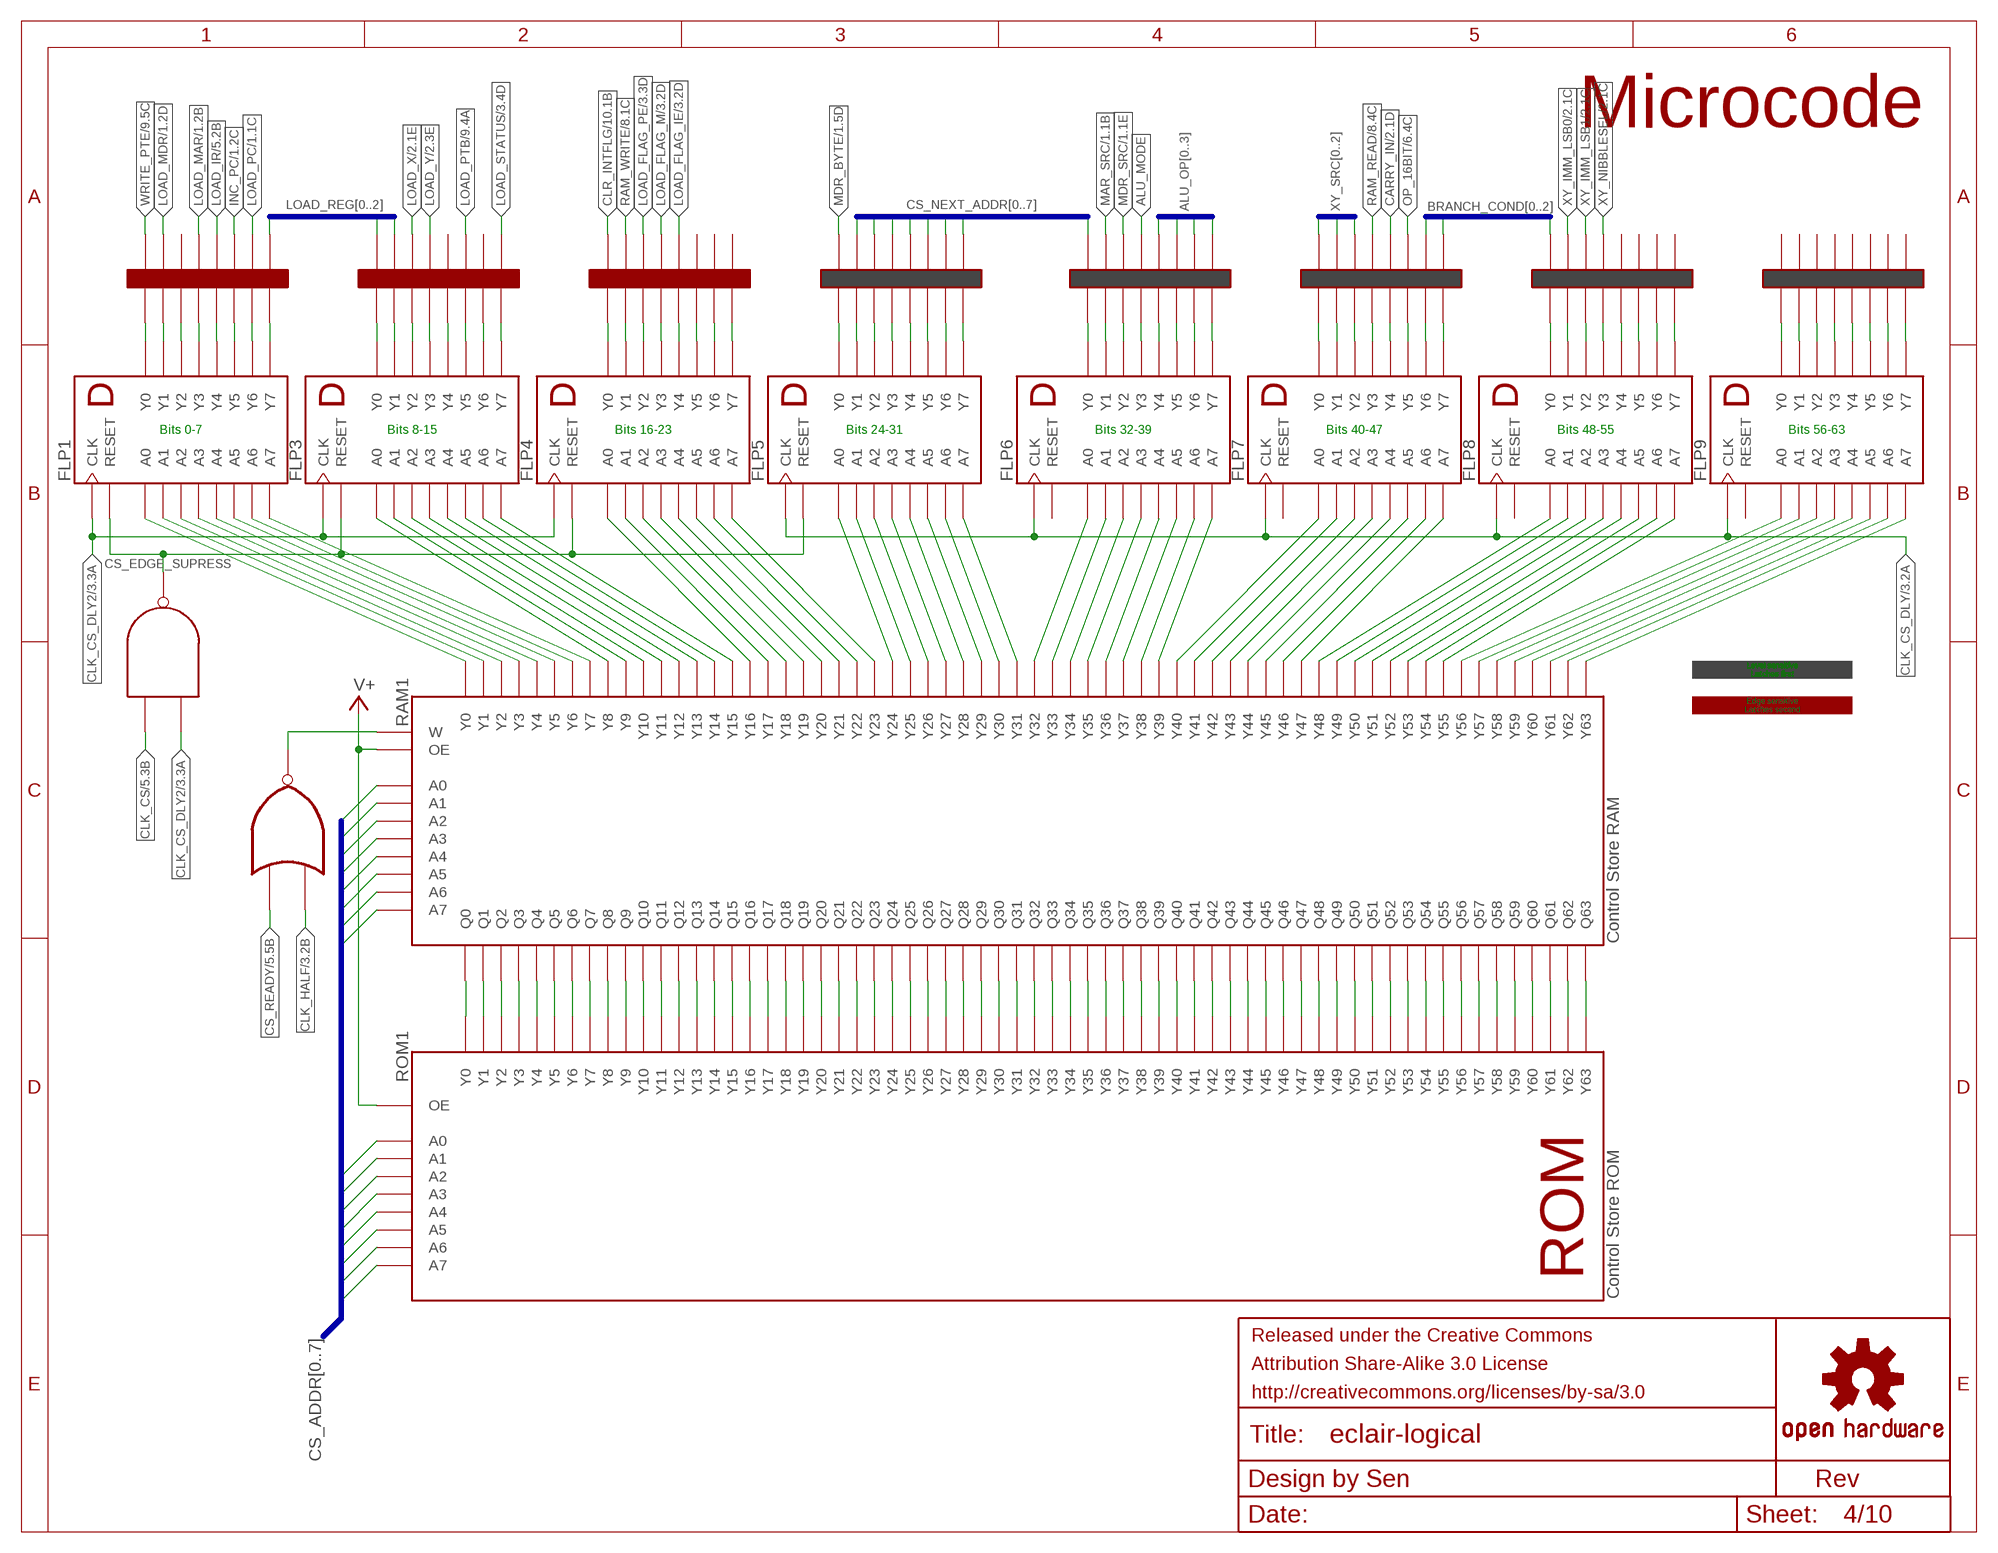
[diagram p3: schematic, sheet 4]

### Parts
FLP1  FLIPFLOP-D  [NULL]
FLP3  FLIPFLOP-D  [NULL]
FLP4  FLIPFLOP-D  [NULL]
FLP5  FLIPFLOP-D  [NULL]
FLP6  FLIPFLOP-D  [NULL]
FLP7  FLIPFLOP-D  [NULL]
FLP8  FLIPFLOP-D  [NULL]
FLP9  FLIPFLOP-D  [NULL]
FRAME2  FRAME-LETTER-GRID-OSHW-SEN  [CC-BY-SA-3.0-LARGE]
LINK1  LINKS-8  [NULL]
LINK2  LINKS-8  [NULL]
LINK3  LINKS-8  [NULL]
LINK4  LINKS-8  [NULL]
LINK5  LINKS-8  [NULL]
LINK6  LINKS-8  [NULL]
LINK7  LINKS-8  [NULL]
LINK8  LINKS-8  [NULL]
NAND1  NAND-2  [NULL]
NOR1  NOR-2  [NULL]
RAM1  Control Store RAM  RAM-A8D64  [NULL]
ROM1  Control Store ROM  ROM-A8D64  [NULL]

### Nets
ALU_MODE: LINK5.P$12(B4) ; also sheet 2
ALU_OP0: LINK5.P$13(B5) ; also sheet 2
ALU_OP1: LINK5.P$14(B6) ; also sheet 2
ALU_OP2: LINK5.P$15(B7) ; also sheet 2
ALU_OP3: LINK5.P$16(B8) ; also sheet 2
BRANCH_COND0: LINK6.P$15(B7) ; also sheet 7
BRANCH_COND1: LINK6.P$16(B8) ; also sheet 7
BRANCH_COND2: LINK7.P$9(B1) ; also sheet 7
CARRY_IN: LINK6.P$13(B5) ; also sheet 2
CLK_CS: NAND1.P$1(A) ; also sheet 3,5
CLK_CS_DLY: FLP5.P$9(CLK) FLP6.P$9(CLK) FLP7.P$9(CLK) FLP8.P$9(CLK) FLP9.P$9(CLK) ; also sheet 3
CLK_CS_DLY2: FLP1.P$9(CLK) FLP3.P$9(CLK) FLP4.P$9(CLK) NAND1.P$2(B) ; also sheet 3
CLK_HALF: NOR1.P$2(B) ; also sheet 3
CLR_INTFLG: LINK3.P$9(B1) ; also sheet 10
CS_ADDR0: RAM1.P$1(A0) ROM1.P$1(A0) ; also sheet 5
CS_ADDR1: RAM1.P$2(A1) ROM1.P$2(A1) ; also sheet 5
CS_ADDR2: RAM1.P$3(A2) ROM1.P$3(A2) ; also sheet 5
CS_ADDR3: RAM1.P$4(A3) ROM1.P$4(A3) ; also sheet 5
CS_ADDR4: RAM1.P$5(A4) ROM1.P$5(A4) ; also sheet 5
CS_ADDR5: RAM1.P$6(A5) ROM1.P$6(A5) ; also sheet 5
CS_ADDR6: RAM1.P$7(A6) ROM1.P$7(A6) ; also sheet 5
CS_ADDR7: RAM1.P$8(A7) ROM1.P$8(A7) ; also sheet 5
CS_DATA0: FLP1.P$11(Y0) LINK1.P$1(A1)
CS_DATA1: FLP1.P$12(Y1) LINK1.P$2(A2)
CS_DATA2: FLP1.P$13(Y2) LINK1.P$3(A3)
CS_DATA3: FLP1.P$14(Y3) LINK1.P$4(A4)
CS_DATA4: FLP1.P$15(Y4) LINK1.P$5(A5)
CS_DATA5: FLP1.P$16(Y5) LINK1.P$6(A6)
CS_DATA6: FLP1.P$17(Y6) LINK1.P$7(A7)
CS_DATA7: FLP1.P$18(Y7) LINK1.P$8(A8)
CS_DATA9: FLP3.P$12(Y1) LINK2.P$2(A2)
CS_DATA10: FLP3.P$13(Y2) LINK2.P$3(A3)
CS_DATA11: FLP3.P$14(Y3) LINK2.P$4(A4)
CS_DATA12: FLP3.P$15(Y4) LINK2.P$5(A5)
CS_DATA13: FLP3.P$16(Y5) LINK2.P$6(A6)
CS_DATA14: FLP3.P$17(Y6) LINK2.P$7(A7)
CS_DATA15: FLP3.P$18(Y7) LINK2.P$8(A8)
CS_DATA16: FLP4.P$11(Y0) LINK3.P$1(A1)
CS_DATA17: FLP4.P$12(Y1) LINK3.P$2(A2)
CS_DATA18: FLP4.P$13(Y2) LINK3.P$3(A3)
CS_DATA19: FLP4.P$14(Y3) LINK3.P$4(A4)
CS_DATA20: FLP4.P$15(Y4) LINK3.P$5(A5)
CS_DATA21: FLP4.P$16(Y5) LINK3.P$6(A6)
CS_DATA22: FLP4.P$17(Y6) LINK3.P$7(A7)
CS_DATA23: FLP4.P$18(Y7) LINK3.P$8(A8)
CS_DATA24: FLP5.P$11(Y0) LINK4.P$1(A1)
CS_DATA25: FLP5.P$12(Y1) LINK4.P$2(A2)
CS_DATA26: FLP5.P$13(Y2) LINK4.P$3(A3)
CS_DATA27: FLP5.P$14(Y3) LINK4.P$4(A4)
CS_DATA28: FLP5.P$15(Y4) LINK4.P$5(A5)
CS_DATA29: FLP5.P$16(Y5) LINK4.P$6(A6)
CS_DATA30: FLP5.P$17(Y6) LINK4.P$7(A7)
CS_DATA31: FLP5.P$18(Y7) LINK4.P$8(A8)
CS_DATA32: FLP6.P$11(Y0) LINK5.P$1(A1)
CS_DATA33: FLP6.P$12(Y1) LINK5.P$2(A2)
CS_DATA34: FLP6.P$13(Y2) LINK5.P$3(A3)
CS_DATA35: FLP6.P$14(Y3) LINK5.P$4(A4)
CS_DATA36: FLP6.P$15(Y4) LINK5.P$5(A5)
CS_DATA37: FLP6.P$16(Y5) LINK5.P$6(A6)
CS_DATA38: FLP6.P$17(Y6) LINK5.P$7(A7)
CS_DATA39: FLP6.P$18(Y7) LINK5.P$8(A8)
CS_DATA40: FLP7.P$11(Y0) LINK6.P$1(A1)
CS_DATA41: FLP7.P$12(Y1) LINK6.P$2(A2)
CS_DATA42: FLP7.P$13(Y2) LINK6.P$3(A3)
CS_DATA43: FLP7.P$14(Y3) LINK6.P$4(A4)
CS_DATA44: FLP7.P$15(Y4) LINK6.P$5(A5)
CS_DATA45: FLP7.P$16(Y5) LINK6.P$6(A6)
CS_DATA46: FLP7.P$17(Y6) LINK6.P$7(A7)
CS_DATA47: FLP7.P$18(Y7) LINK6.P$8(A8)
CS_DATA48: FLP8.P$11(Y0) LINK7.P$1(A1)
CS_DATA49: FLP8.P$12(Y1) LINK7.P$2(A2)
CS_DATA50: FLP8.P$13(Y2) LINK7.P$3(A3)
CS_DATA51: FLP8.P$14(Y3) LINK7.P$4(A4)
CS_DATA52: FLP8.P$15(Y4) LINK7.P$5(A5)
CS_DATA53: FLP8.P$16(Y5) LINK7.P$6(A6)
CS_DATA54: FLP8.P$17(Y6) LINK7.P$7(A7)
CS_DATA55: FLP8.P$18(Y7) LINK7.P$8(A8)
CS_DATA56: FLP9.P$11(Y0) LINK8.P$1(A1)
CS_DATA57: FLP9.P$12(Y1) LINK8.P$2(A2)
CS_DATA58: FLP9.P$13(Y2) LINK8.P$3(A3)
CS_DATA59: FLP9.P$14(Y3) LINK8.P$4(A4)
CS_DATA60: FLP9.P$15(Y4) LINK8.P$5(A5)
CS_DATA61: FLP9.P$16(Y5) LINK8.P$6(A6)
CS_DATA63: FLP9.P$18(Y7) LINK8.P$8(A8)
CS_DATA_PRELATCH0: FLP1.P$1(A0) RAM1.P$75(Y0)
CS_DATA_PRELATCH1: FLP1.P$2(A1) RAM1.P$76(Y1)
CS_DATA_PRELATCH2: FLP1.P$3(A2) RAM1.P$77(Y2)
CS_DATA_PRELATCH3: FLP1.P$4(A3) RAM1.P$78(Y3)
CS_DATA_PRELATCH4: FLP1.P$5(A4) RAM1.P$79(Y4)
CS_DATA_PRELATCH5: FLP1.P$6(A5) RAM1.P$80(Y5)
CS_DATA_PRELATCH6: FLP1.P$7(A6) RAM1.P$81(Y6)
CS_DATA_PRELATCH7: FLP1.P$8(A7) RAM1.P$82(Y7)
CS_DATA_PRELATCH8: FLP3.P$1(A0) RAM1.P$83(Y8)
CS_DATA_PRELATCH9: FLP3.P$2(A1) RAM1.P$84(Y9)
CS_DATA_PRELATCH10: FLP3.P$3(A2) RAM1.P$85(Y10)
CS_DATA_PRELATCH11: FLP3.P$4(A3) RAM1.P$86(Y11)
CS_DATA_PRELATCH12: FLP3.P$5(A4) RAM1.P$87(Y12)
CS_DATA_PRELATCH13: FLP3.P$6(A5) RAM1.P$88(Y13)
CS_DATA_PRELATCH14: FLP3.P$7(A6) RAM1.P$89(Y14)
CS_DATA_PRELATCH15: FLP3.P$8(A7) RAM1.P$90(Y15)
CS_DATA_PRELATCH16: FLP4.P$1(A0) RAM1.P$91(Y16)
CS_DATA_PRELATCH17: FLP4.P$2(A1) RAM1.P$92(Y17)
CS_DATA_PRELATCH18: FLP4.P$3(A2) RAM1.P$93(Y18)
CS_DATA_PRELATCH19: FLP4.P$4(A3) RAM1.P$94(Y19)
CS_DATA_PRELATCH20: FLP4.P$5(A4) RAM1.P$95(Y20)
CS_DATA_PRELATCH21: FLP4.P$6(A5) RAM1.P$96(Y21)
CS_DATA_PRELATCH22: FLP4.P$7(A6) RAM1.P$97(Y22)
CS_DATA_PRELATCH23: FLP4.P$8(A7) RAM1.P$98(Y23)
CS_DATA_PRELATCH24: FLP5.P$1(A0) RAM1.P$99(Y24)
CS_DATA_PRELATCH25: FLP5.P$2(A1) RAM1.P$100(Y25)
CS_DATA_PRELATCH26: FLP5.P$3(A2) RAM1.P$101(Y26)
CS_DATA_PRELATCH27: FLP5.P$4(A3) RAM1.P$102(Y27)
CS_DATA_PRELATCH28: FLP5.P$5(A4) RAM1.P$103(Y28)
CS_DATA_PRELATCH29: FLP5.P$6(A5) RAM1.P$104(Y29)
CS_DATA_PRELATCH30: FLP5.P$7(A6) RAM1.P$105(Y30)
CS_DATA_PRELATCH31: FLP5.P$8(A7) RAM1.P$106(Y31)
CS_DATA_PRELATCH32: FLP6.P$1(A0) RAM1.P$107(Y32)
CS_DATA_PRELATCH33: FLP6.P$2(A1) RAM1.P$108(Y33)
CS_DATA_PRELATCH34: FLP6.P$3(A2) RAM1.P$109(Y34)
CS_DATA_PRELATCH35: FLP6.P$4(A3) RAM1.P$110(Y35)
CS_DATA_PRELATCH36: FLP6.P$5(A4) RAM1.P$111(Y36)
CS_DATA_PRELATCH37: FLP6.P$6(A5) RAM1.P$112(Y37)
CS_DATA_PRELATCH38: FLP6.P$7(A6) RAM1.P$113(Y38)
CS_DATA_PRELATCH39: FLP6.P$8(A7) RAM1.P$114(Y39)
CS_DATA_PRELATCH40: FLP7.P$1(A0) RAM1.P$115(Y40)
CS_DATA_PRELATCH41: FLP7.P$2(A1) RAM1.P$116(Y41)
CS_DATA_PRELATCH42: FLP7.P$3(A2) RAM1.P$117(Y42)
CS_DATA_PRELATCH43: FLP7.P$4(A3) RAM1.P$118(Y43)
CS_DATA_PRELATCH44: FLP7.P$5(A4) RAM1.P$119(Y44)
CS_DATA_PRELATCH45: FLP7.P$6(A5) RAM1.P$120(Y45)
CS_DATA_PRELATCH46: FLP7.P$7(A6) RAM1.P$121(Y46)
CS_DATA_PRELATCH47: FLP7.P$8(A7) RAM1.P$122(Y47)
CS_DATA_PRELATCH48: FLP8.P$1(A0) RAM1.P$123(Y48)
CS_DATA_PRELATCH49: FLP8.P$2(A1) RAM1.P$124(Y49)
CS_DATA_PRELATCH50: FLP8.P$3(A2) RAM1.P$125(Y50)
CS_DATA_PRELATCH51: FLP8.P$4(A3) RAM1.P$126(Y51)
CS_DATA_PRELATCH52: FLP8.P$5(A4) RAM1.P$127(Y52)
CS_DATA_PRELATCH53: FLP8.P$6(A5) RAM1.P$128(Y53)
CS_DATA_PRELATCH54: FLP8.P$7(A6) RAM1.P$129(Y54)
CS_DATA_PRELATCH55: FLP8.P$8(A7) RAM1.P$130(Y55)
CS_DATA_PRELATCH56: FLP9.P$1(A0) RAM1.P$131(Y56)
CS_DATA_PRELATCH57: FLP9.P$2(A1) RAM1.P$132(Y57)
CS_DATA_PRELATCH58: FLP9.P$3(A2) RAM1.P$133(Y58)
CS_DATA_PRELATCH59: FLP9.P$4(A3) RAM1.P$134(Y59)
CS_DATA_PRELATCH60: FLP9.P$5(A4) RAM1.P$135(Y60)
CS_DATA_PRELATCH61: FLP9.P$6(A5) RAM1.P$136(Y61)
CS_DATA_PRELATCH62: FLP9.P$7(A6) RAM1.P$137(Y62)
CS_DATA_PRELATCH63: FLP9.P$8(A7) RAM1.P$138(Y63)
CS_EDGE_SUPRESS: FLP1.P$10(RESET) FLP3.P$10(RESET) FLP4.P$10(RESET) FLP5.P$10(RESET) NAND1.P$3(Y)
CS_NEXT_ADDR0: LINK4.P$10(B2) ; also sheet 5,7
CS_NEXT_ADDR1: LINK4.P$11(B3) ; also sheet 5,7
CS_NEXT_ADDR2: LINK4.P$12(B4) ; also sheet 5,7
CS_NEXT_ADDR3: LINK4.P$13(B5) ; also sheet 5,7
CS_NEXT_ADDR4: LINK4.P$14(B6) ; also sheet 5,7
CS_NEXT_ADDR5: LINK4.P$15(B7) ; also sheet 5,7
CS_NEXT_ADDR6: LINK4.P$16(B8) ; also sheet 5,7
CS_NEXT_ADDR7: LINK5.P$9(B1) ; also sheet 5,7
CS_READY: NOR1.P$1(A) ; also sheet 3,5,9
INC_PC: LINK1.P$14(B6) ; also sheet 1
LOAD_FLAG_IE: LINK3.P$13(B5) ; also sheet 3
LOAD_FLAG_M: LINK3.P$12(B4) ; also sheet 3
LOAD_FLAG_PE: LINK3.P$11(B3) ; also sheet 3
LOAD_IR: LINK1.P$13(B5) ; also sheet 5
LOAD_MAR: LINK1.P$12(B4) ; also sheet 1
LOAD_MDR: LINK1.P$10(B2) ; also sheet 1
LOAD_PC: LINK1.P$15(B7) ; also sheet 1
LOAD_PTB: LINK2.P$14(B6) ; also sheet 9
LOAD_REG0: LINK1.P$16(B8) ; also sheet 7
LOAD_REG1: LINK2.P$9(B1) ; also sheet 7
LOAD_REG2: LINK2.P$10(B2) ; also sheet 7
LOAD_STATUS: LINK2.P$16(B8) ; also sheet 3
LOAD_X: LINK2.P$11(B3) ; also sheet 2
LOAD_Y: LINK2.P$12(B4) ; also sheet 2
MAR_SRC: LINK5.P$10(B2) ; also sheet 1
MDR_BYTE: LINK4.P$9(B1) ; also sheet 1
MDR_SRC: LINK5.P$11(B3) ; also sheet 1
N$14: RAM1.P$10(Q0) ROM1.P$11(Y0)
N$15: RAM1.P$11(Q1) ROM1.P$12(Y1)
N$16: RAM1.P$12(Q2) ROM1.P$13(Y2)
N$17: RAM1.P$13(Q3) ROM1.P$14(Y3)
N$33: RAM1.P$14(Q4) ROM1.P$15(Y4)
N$34: RAM1.P$15(Q5) ROM1.P$16(Y5)
N$35: RAM1.P$16(Q6) ROM1.P$17(Y6)
N$36: RAM1.P$17(Q7) ROM1.P$18(Y7)
N$37: RAM1.P$18(Q8) ROM1.P$19(Y8)
N$38: RAM1.P$19(Q9) ROM1.P$20(Y9)
N$39: RAM1.P$20(Q10) ROM1.P$21(Y10)
N$40: RAM1.P$21(Q11) ROM1.P$22(Y11)
N$41: RAM1.P$22(Q12) ROM1.P$23(Y12)
N$42: RAM1.P$23(Q13) ROM1.P$24(Y13)
N$43: RAM1.P$24(Q14) ROM1.P$25(Y14)
N$44: RAM1.P$25(Q15) ROM1.P$26(Y15)
N$45: RAM1.P$26(Q16) ROM1.P$27(Y16)
N$46: RAM1.P$27(Q17) ROM1.P$28(Y17)
N$47: RAM1.P$28(Q18) ROM1.P$29(Y18)
N$48: RAM1.P$29(Q19) ROM1.P$30(Y19)
N$49: RAM1.P$30(Q20) ROM1.P$31(Y20)
N$50: RAM1.P$31(Q21) ROM1.P$32(Y21)
N$51: RAM1.P$32(Q22) ROM1.P$33(Y22)
N$52: RAM1.P$33(Q23) ROM1.P$34(Y23)
N$53: RAM1.P$34(Q24) ROM1.P$35(Y24)
N$54: RAM1.P$35(Q25) ROM1.P$36(Y25)
N$55: RAM1.P$36(Q26) ROM1.P$37(Y26)
N$56: RAM1.P$37(Q27) ROM1.P$38(Y27)
N$57: RAM1.P$38(Q28) ROM1.P$39(Y28)
N$58: RAM1.P$39(Q29) ROM1.P$40(Y29)
N$59: RAM1.P$40(Q30) ROM1.P$41(Y30)
N$60: RAM1.P$41(Q31) ROM1.P$42(Y31)
N$61: RAM1.P$42(Q32) ROM1.P$43(Y32)
N$62: RAM1.P$43(Q33) ROM1.P$44(Y33)
N$63: RAM1.P$44(Q34) ROM1.P$45(Y34)
N$64: RAM1.P$45(Q35) ROM1.P$46(Y35)
N$65: RAM1.P$46(Q36) ROM1.P$47(Y36)
N$66: RAM1.P$47(Q37) ROM1.P$48(Y37)
N$67: RAM1.P$48(Q38) ROM1.P$49(Y38)
N$68: RAM1.P$49(Q39) ROM1.P$50(Y39)
N$69: RAM1.P$50(Q40) ROM1.P$51(Y40)
N$70: RAM1.P$51(Q41) ROM1.P$52(Y41)
N$71: RAM1.P$52(Q42) ROM1.P$53(Y42)
N$72: RAM1.P$53(Q43) ROM1.P$54(Y43)
N$73: RAM1.P$54(Q44) ROM1.P$55(Y44)
N$74: RAM1.P$55(Q45) ROM1.P$56(Y45)
N$75: RAM1.P$56(Q46) ROM1.P$57(Y46)
N$76: RAM1.P$57(Q47) ROM1.P$58(Y47)
N$77: RAM1.P$58(Q48) ROM1.P$59(Y48)
N$78: RAM1.P$59(Q49) ROM1.P$60(Y49)
N$79: RAM1.P$60(Q50) ROM1.P$61(Y50)
N$80: RAM1.P$61(Q51) ROM1.P$62(Y51)
N$81: RAM1.P$62(Q52) ROM1.P$63(Y52)
N$82: RAM1.P$63(Q53) ROM1.P$64(Y53)
N$83: RAM1.P$64(Q54) ROM1.P$65(Y54)
N$84: RAM1.P$65(Q55) ROM1.P$66(Y55)
N$85: RAM1.P$66(Q56) ROM1.P$67(Y56)
N$86: RAM1.P$67(Q57) ROM1.P$68(Y57)
N$87: RAM1.P$68(Q58) ROM1.P$69(Y58)
N$88: RAM1.P$69(Q59) ROM1.P$70(Y59)
N$89: RAM1.P$70(Q60) ROM1.P$71(Y60)
N$90: RAM1.P$71(Q61) ROM1.P$72(Y61)
N$91: RAM1.P$72(Q62) ROM1.P$73(Y62)
N$92: RAM1.P$73(Q63) ROM1.P$74(Y63)
N$93: FLP3.P$11(Y0) LINK2.P$1(A1)
N$94: NOR1.P$3(Y) RAM1.P$74(W)
N$157: FLP9.P$17(Y6) LINK8.P$7(A7)
OP_16BIT: LINK6.P$14(B6) ; also sheet 3,6
RAM_READ: LINK6.P$12(B4) ; also sheet 8
RAM_WRITE: LINK3.P$10(B2) ; also sheet 8
V+: RAM1.P$9(OE) ROM1.P$9(OE) ; also sheet 1,5,7,10
WRITE_PTE: LINK1.P$9(B1) ; also sheet 9
XY_IMM_LSB0: LINK7.P$10(B2) ; also sheet 2
XY_IMM_LSB1: LINK7.P$11(B3) ; also sheet 2
XY_NIBBLESEL: LINK7.P$12(B4) ; also sheet 2
XY_SRC0: LINK6.P$9(B1) ; also sheet 2
XY_SRC1: LINK6.P$10(B2) ; also sheet 2
XY_SRC2: LINK6.P$11(B3) ; also sheet 2
Unconnected: FLP6.P$10(RESET) FLP7.P$10(RESET) FLP8.P$10(RESET) FLP9.P$10(RESET) LINK1.P$11(B3) LINK2.P$13(B5) LINK2.P$15(B7) LINK3.P$14(B6) LINK3.P$15(B7) LINK3.P$16(B8) LINK7.P$13(B5) LINK7.P$14(B6) LINK7.P$15(B7) LINK7.P$16(B8) LINK8.P$9(B1) LINK8.P$10(B2) LINK8.P$11(B3) LINK8.P$12(B4) LINK8.P$13(B5) LINK8.P$14(B6) LINK8.P$15(B7) LINK8.P$16(B8)

### Buses
CS_ADDR[0..7]
LOAD_REG[0..2]
CS_NEXT_ADDR[0..7]
XY_SRC[0..2]
ALU_OP[0..3]
BRANCH_COND[0..2]

### Notes on the sheet
- Microcode
- Bits 0-7 | Bits 8-15 | Bits 16-23 | Bits 24-31 | Bits 32-39 | Bits 40-47 | Bits 48-55 | Bits 56-63
- Level sensitive
  Latches first
- Edge sensitive
  Latches second

## Sheet 5 of 10: Sequencing
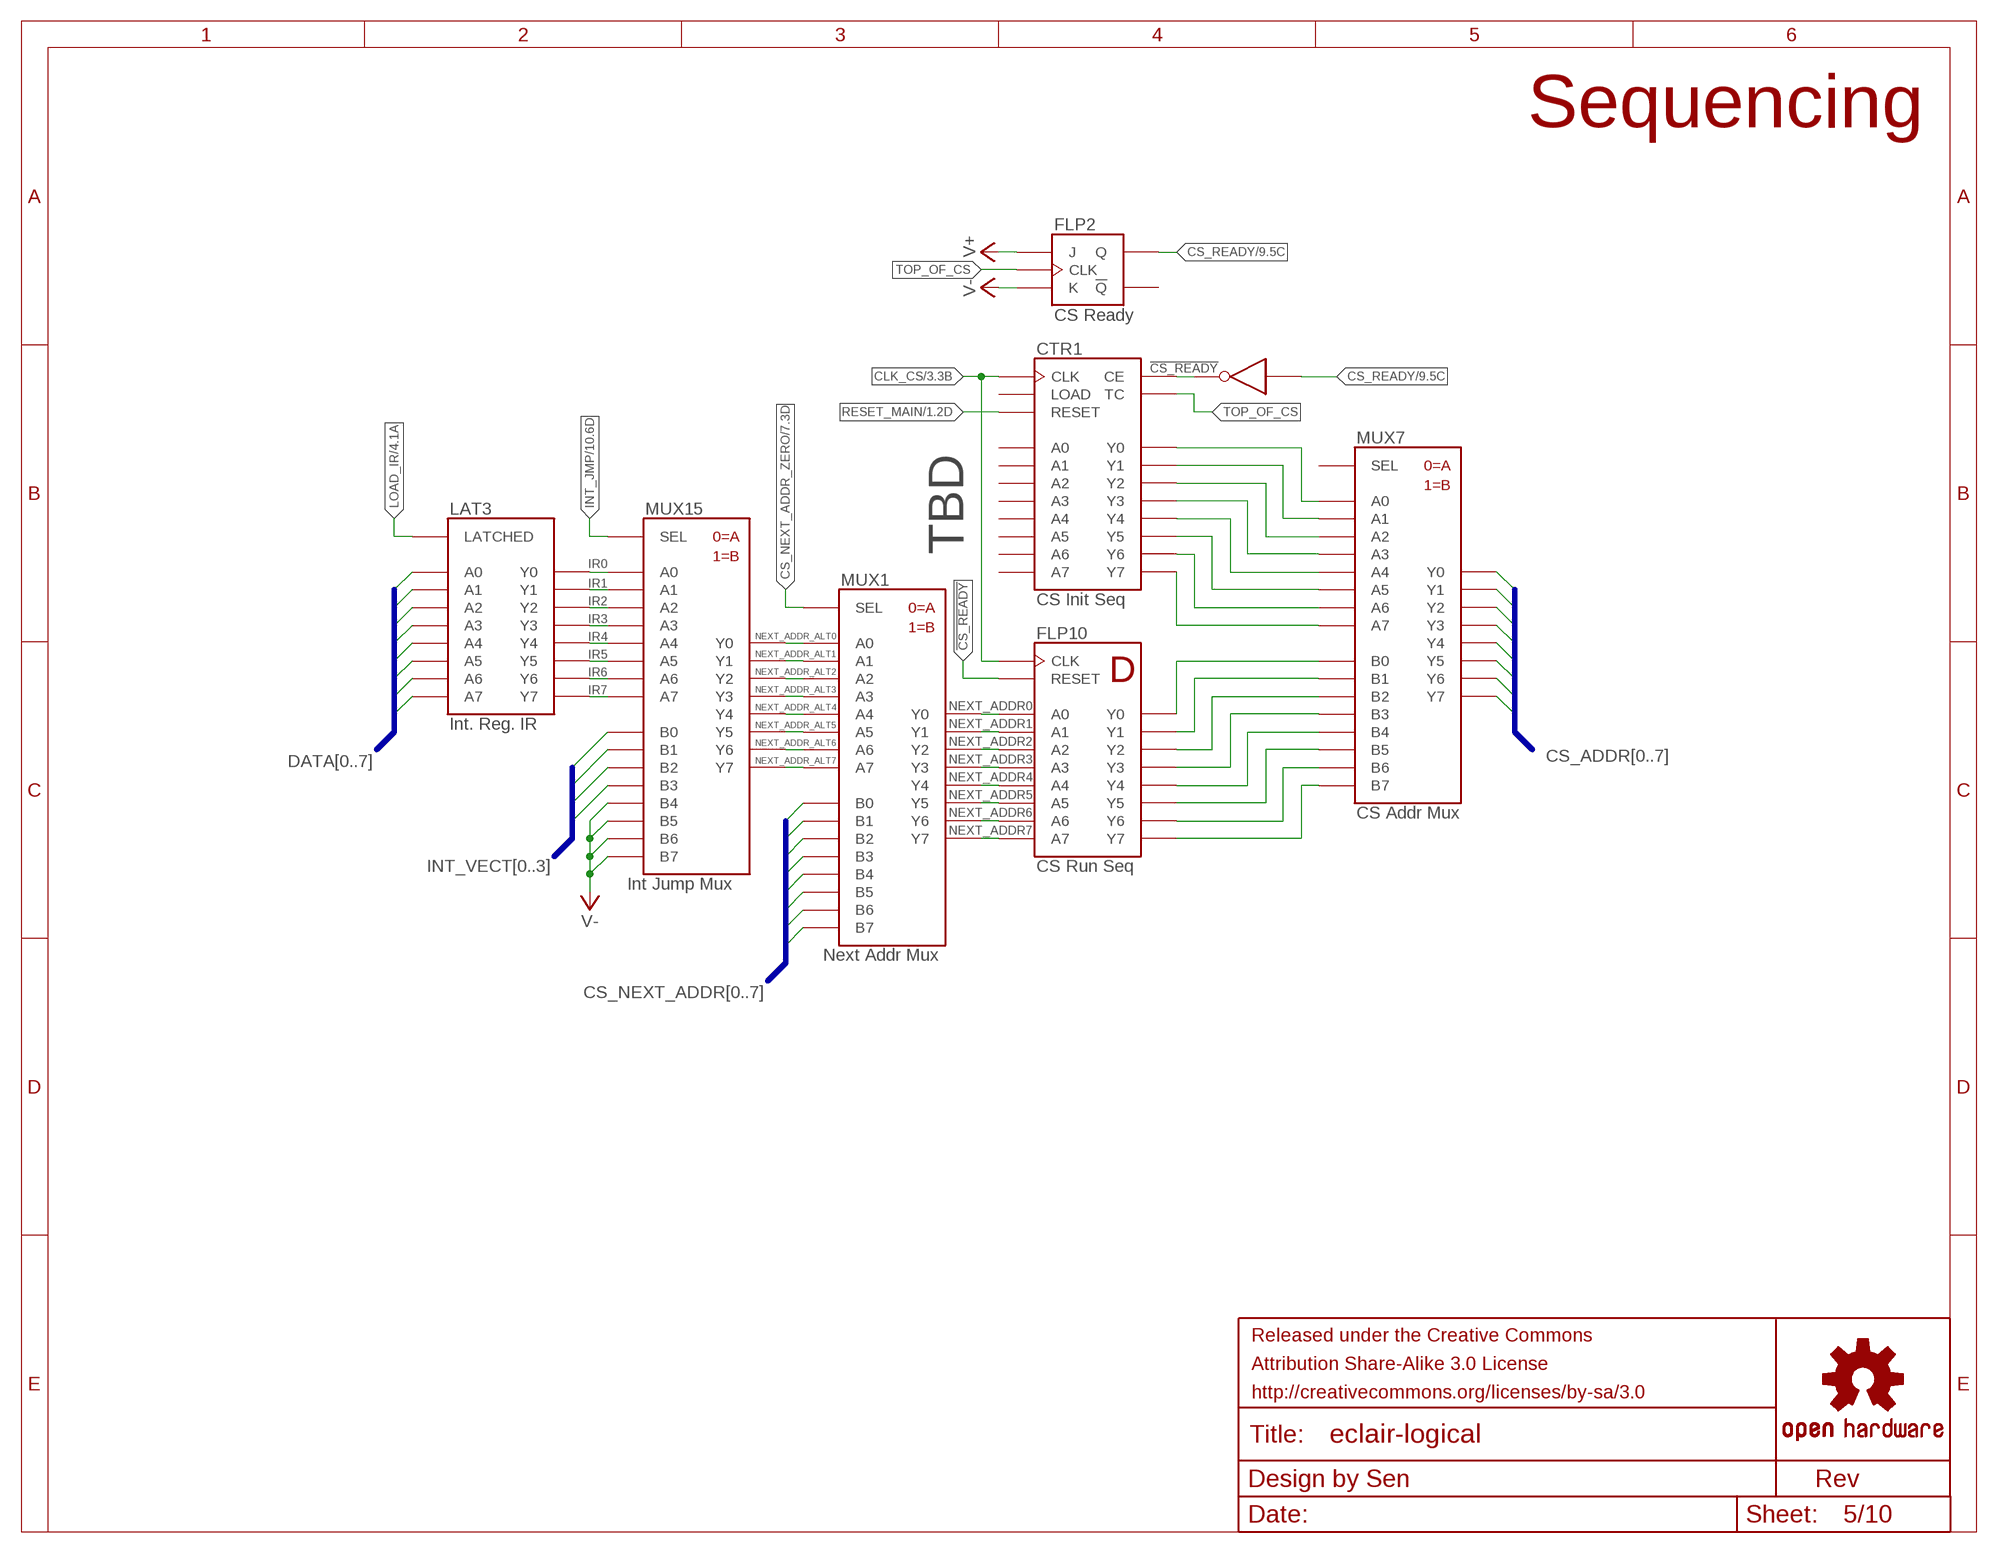
[diagram p4: schematic, sheet 5]

### Parts
CTR1  CS Init Seq  COUNTER-8-LR  [NULL]
FLP2  CS Ready  FLIPFLOP-JK  [NULL]
FLP10  CS Run Seq  FLIPFLOP-D  [NULL]
FRAME3  FRAME-LETTER-GRID-OSHW-SEN  [CC-BY-SA-3.0-LARGE]
LAT3  Int. Reg. IR  LATCH-8  [NULL]
MUX1  Next Addr Mux  MUX-2X8  [NULL]
MUX7  CS Addr Mux  MUX-2X8  [NULL]
MUX15  Int Jump Mux  MUX-2X8  [NULL]
NOT2  NOT  [NULL]

### Nets
!CS_READY: CTR1.P$20(CE) FLP10.P$10(RESET) NOT2.P$2(Y)
CLK_CS: CTR1.P$9(CLK) FLP10.P$9(CLK) ; also sheet 3,4
CS_ADDR0: MUX7.P$18(Y0) ; also sheet 4
CS_ADDR1: MUX7.P$19(Y1) ; also sheet 4
CS_ADDR2: MUX7.P$20(Y2) ; also sheet 4
CS_ADDR3: MUX7.P$21(Y3) ; also sheet 4
CS_ADDR4: MUX7.P$22(Y4) ; also sheet 4
CS_ADDR5: MUX7.P$23(Y5) ; also sheet 4
CS_ADDR6: MUX7.P$24(Y6) ; also sheet 4
CS_ADDR7: MUX7.P$25(Y7) ; also sheet 4
CS_ADDR_RUN0: FLP10.P$11(Y0) MUX7.P$9(B0)
CS_ADDR_RUN1: FLP10.P$12(Y1) MUX7.P$10(B1)
CS_ADDR_RUN2: FLP10.P$13(Y2) MUX7.P$11(B2)
CS_ADDR_RUN3: FLP10.P$14(Y3) MUX7.P$12(B3)
CS_ADDR_RUN4: FLP10.P$15(Y4) MUX7.P$13(B4)
CS_ADDR_RUN5: FLP10.P$16(Y5) MUX7.P$14(B5)
CS_ADDR_RUN6: FLP10.P$17(Y6) MUX7.P$15(B6)
CS_ADDR_RUN7: FLP10.P$18(Y7) MUX7.P$16(B7)
CS_NEXT_ADDR0: MUX1.P$9(B0) ; also sheet 4,7
CS_NEXT_ADDR1: MUX1.P$10(B1) ; also sheet 4,7
CS_NEXT_ADDR2: MUX1.P$11(B2) ; also sheet 4,7
CS_NEXT_ADDR3: MUX1.P$12(B3) ; also sheet 4,7
CS_NEXT_ADDR4: MUX1.P$13(B4) ; also sheet 4,7
CS_NEXT_ADDR5: MUX1.P$14(B5) ; also sheet 4,7
CS_NEXT_ADDR6: MUX1.P$15(B6) ; also sheet 4,7
CS_NEXT_ADDR7: MUX1.P$16(B7) ; also sheet 4,7
CS_NEXT_ADDR_ZERO: MUX1.P$17(SEL) ; also sheet 7
CS_READY: FLP2.P$5(Q) NOT2.P$1(Q) ; also sheet 3,4,9
DATA0: LAT3.P$1(A0) ; also sheet 1,8
DATA1: LAT3.P$2(A1) ; also sheet 1,8
DATA2: LAT3.P$3(A2) ; also sheet 1,8
DATA3: LAT3.P$4(A3) ; also sheet 1,8
DATA4: LAT3.P$5(A4) ; also sheet 1,8
DATA5: LAT3.P$6(A5) ; also sheet 1,8
DATA6: LAT3.P$7(A6) ; also sheet 1,8
DATA7: LAT3.P$8(A7) ; also sheet 1,8
INT_JMP: MUX15.P$17(SEL) ; also sheet 10
INT_VECT0: MUX15.P$9(B0)
INT_VECT1: MUX15.P$10(B1)
INT_VECT2: MUX15.P$11(B2)
INT_VECT3: MUX15.P$12(B3)
IR0: LAT3.P$10(Y0) MUX15.P$1(A0)
IR1: LAT3.P$11(Y1) MUX15.P$2(A1)
IR2: LAT3.P$12(Y2) MUX15.P$3(A2)
IR3: LAT3.P$13(Y3) MUX15.P$4(A3)
IR4: LAT3.P$14(Y4) MUX15.P$5(A4)
IR5: LAT3.P$15(Y5) MUX15.P$6(A5)
IR6: LAT3.P$16(Y6) MUX15.P$7(A6) ; also sheet 7
IR7: LAT3.P$17(Y7) MUX15.P$8(A7) ; also sheet 7
LOAD_IR: LAT3.P$9(LATCHED) ; also sheet 4
N$1: CTR1.P$12(Y0) MUX7.P$1(A0)
N$2: CTR1.P$13(Y1) MUX7.P$2(A1)
N$3: CTR1.P$14(Y2) MUX7.P$3(A2)
N$4: CTR1.P$15(Y3) MUX7.P$4(A3)
N$5: CTR1.P$16(Y4) MUX7.P$5(A4)
N$6: CTR1.P$17(Y5) MUX7.P$6(A5)
N$7: CTR1.P$18(Y6) MUX7.P$7(A6)
N$8: CTR1.P$19(Y7) MUX7.P$8(A7)
NEXT_ADDR0: FLP10.P$1(A0) MUX1.P$18(Y0)
NEXT_ADDR1: FLP10.P$2(A1) MUX1.P$19(Y1)
NEXT_ADDR2: FLP10.P$3(A2) MUX1.P$20(Y2)
NEXT_ADDR3: FLP10.P$4(A3) MUX1.P$21(Y3)
NEXT_ADDR4: FLP10.P$5(A4) MUX1.P$22(Y4)
NEXT_ADDR5: FLP10.P$6(A5) MUX1.P$23(Y5)
NEXT_ADDR6: FLP10.P$7(A6) MUX1.P$24(Y6)
NEXT_ADDR7: FLP10.P$8(A7) MUX1.P$25(Y7)
NEXT_ADDR_ALT0: MUX1.P$1(A0) MUX15.P$18(Y0)
NEXT_ADDR_ALT1: MUX1.P$2(A1) MUX15.P$19(Y1)
NEXT_ADDR_ALT2: MUX1.P$3(A2) MUX15.P$20(Y2)
NEXT_ADDR_ALT3: MUX1.P$4(A3) MUX15.P$21(Y3)
NEXT_ADDR_ALT4: MUX1.P$5(A4) MUX15.P$22(Y4)
NEXT_ADDR_ALT5: MUX1.P$6(A5) MUX15.P$23(Y5)
NEXT_ADDR_ALT6: MUX1.P$7(A6) MUX15.P$24(Y6)
NEXT_ADDR_ALT7: MUX1.P$8(A7) MUX15.P$25(Y7)
RESET_MAIN: CTR1.P$11(RESET) ; also sheet 1,3
TOP_OF_CS: CTR1.P$21(TC) FLP2.P$2(CLK)
V+: FLP2.P$3(J) ; also sheet 1,4,7,10
V-: FLP2.P$4(K) MUX15.P$13(B4) MUX15.P$14(B5) MUX15.P$15(B6) MUX15.P$16(B7) ; also sheet 2,9,10
Unconnected: CTR1.P$1(A0) CTR1.P$2(A1) CTR1.P$3(A2) CTR1.P$4(A3) CTR1.P$5(A4) CTR1.P$6(A5) CTR1.P$7(A6) CTR1.P$8(A7) CTR1.P$10(LOAD) FLP2.P$1(!Q) MUX7.P$17(SEL)

### Buses
CS_ADDR[0..7]
DATA[0..7]
CS_NEXT_ADDR[0..7]
INT_VECT[0..3]

### Notes on the sheet
- Sequencing
- TBD

## Sheet 6 of 10: Registers
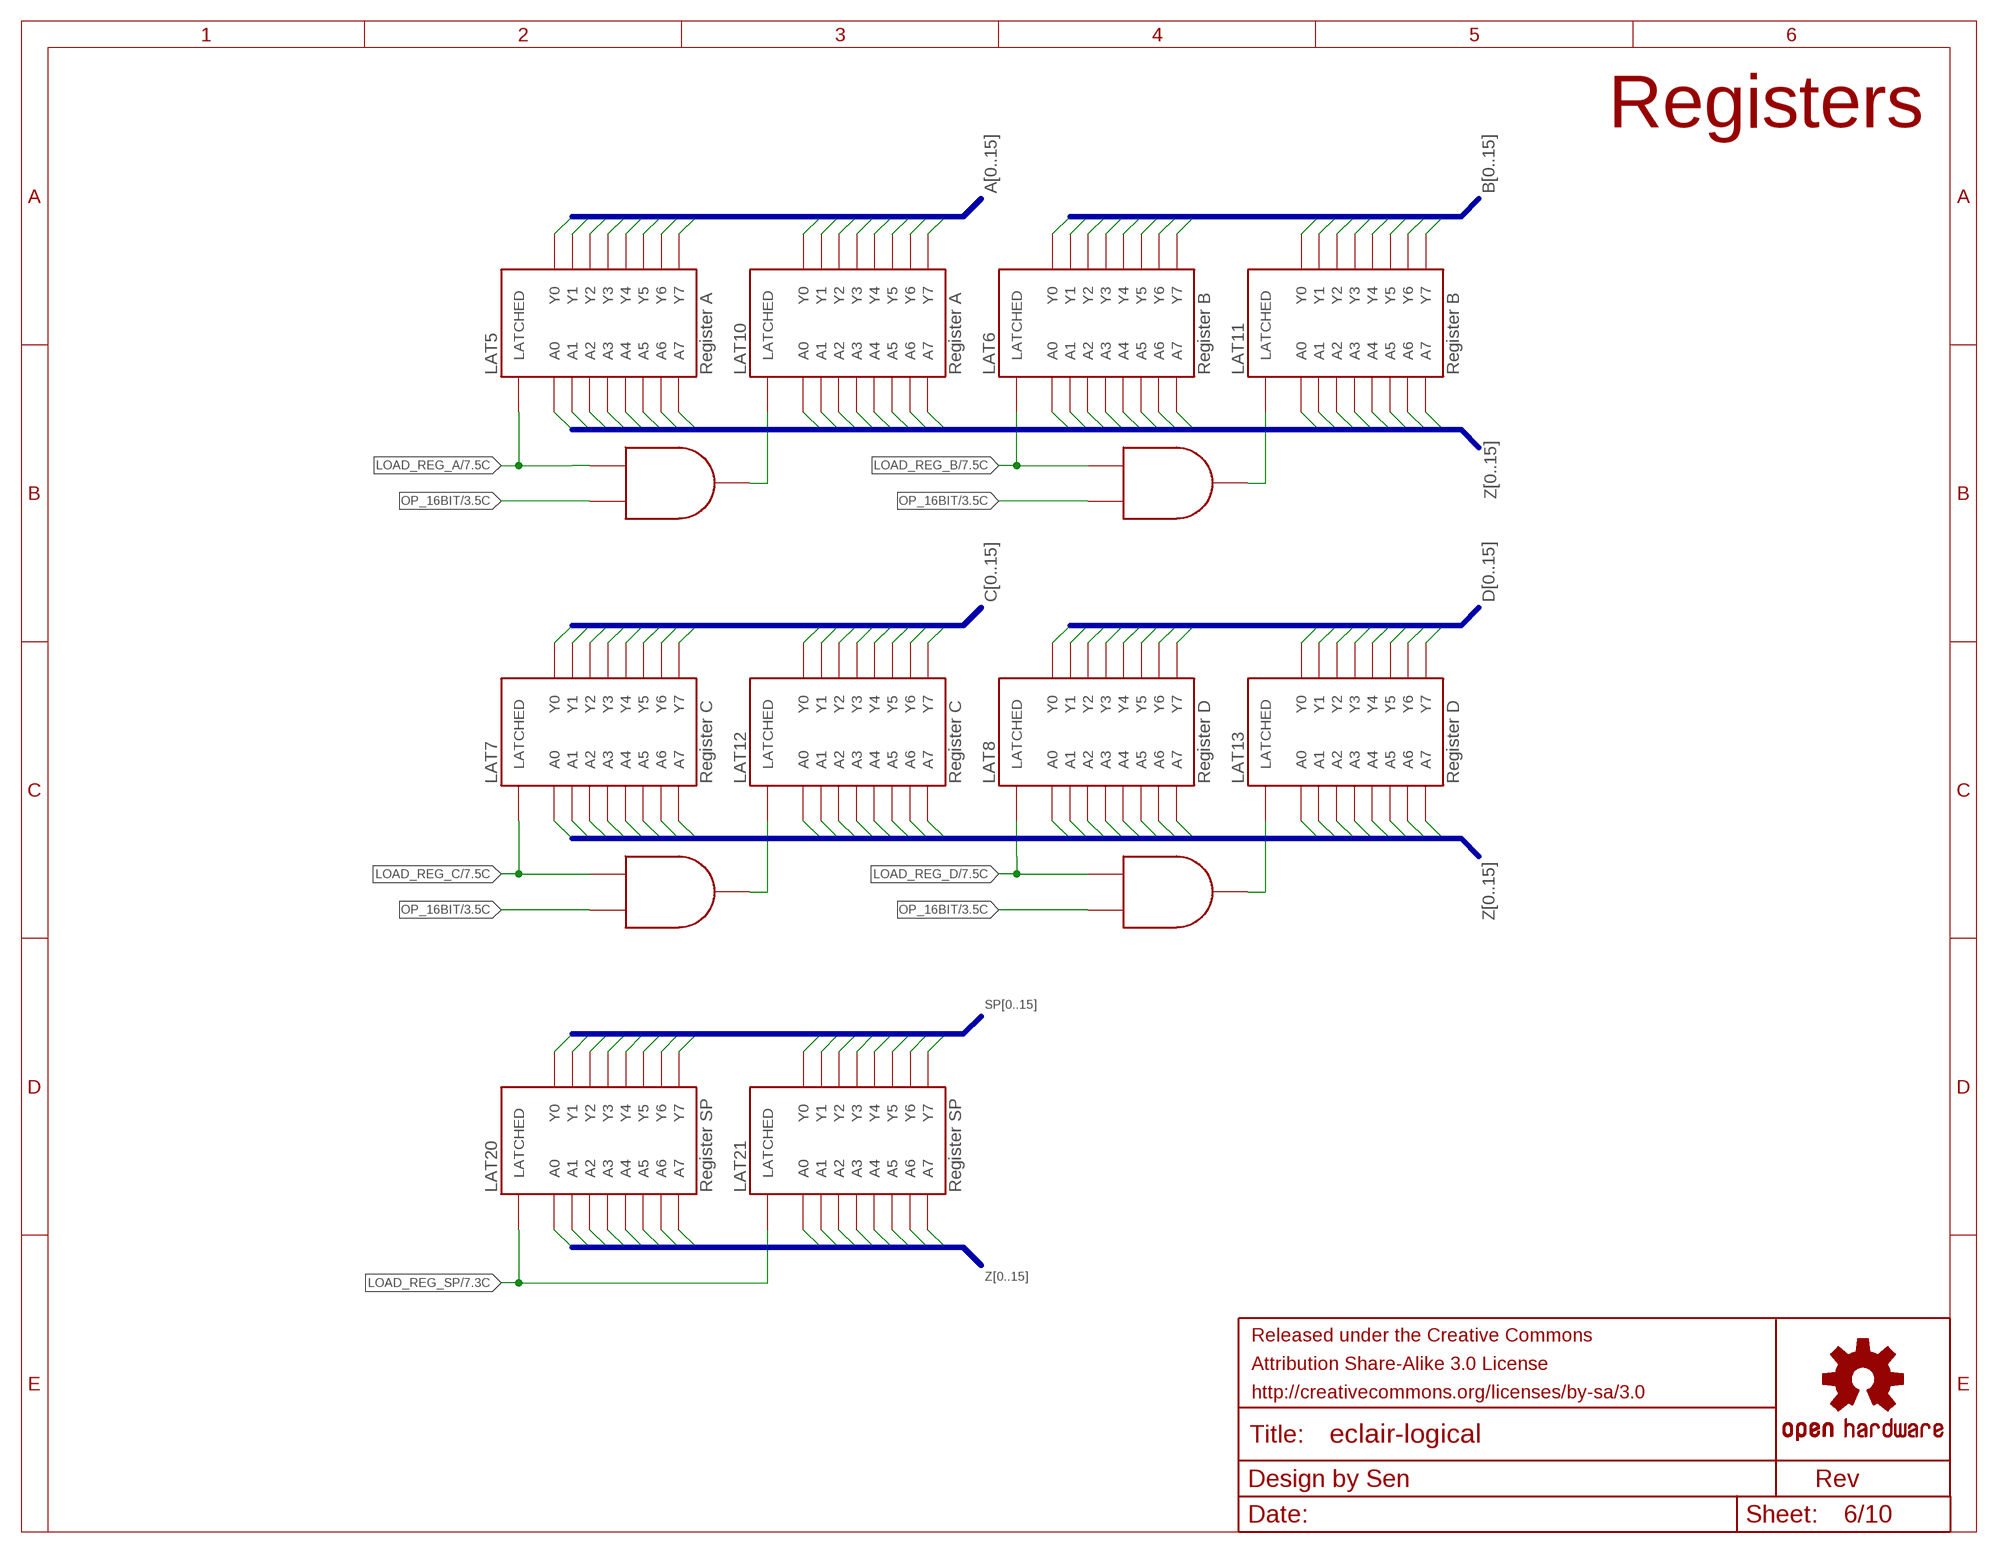
[diagram p5: schematic, sheet 6]

### Parts
AND5  AND-2  [NULL]
AND6  AND-2  [NULL]
AND7  AND-2  [NULL]
AND8  AND-2  [NULL]
FRAME4  FRAME-LETTER-GRID-OSHW-SEN  [CC-BY-SA-3.0-LARGE]
LAT5  Register A  LATCH-8  [NULL]
LAT6  Register B  LATCH-8  [NULL]
LAT7  Register C  LATCH-8  [NULL]
LAT8  Register D  LATCH-8  [NULL]
LAT10  Register A  LATCH-8  [NULL]
LAT11  Register B  LATCH-8  [NULL]
LAT12  Register C  LATCH-8  [NULL]
LAT13  Register D  LATCH-8  [NULL]
LAT20  Register SP  LATCH-8  [NULL]
LAT21  Register SP  LATCH-8  [NULL]

### Nets
A0: LAT5.P$10(Y0) ; also sheet 2
A1: LAT5.P$11(Y1) ; also sheet 2
A2: LAT5.P$12(Y2) ; also sheet 2
A3: LAT5.P$13(Y3) ; also sheet 2
A4: LAT5.P$14(Y4) ; also sheet 2
A5: LAT5.P$15(Y5) ; also sheet 2
A6: LAT5.P$16(Y6) ; also sheet 2
A7: LAT5.P$17(Y7) ; also sheet 2
A8: LAT10.P$10(Y0) ; also sheet 2
A9: LAT10.P$11(Y1) ; also sheet 2
A10: LAT10.P$12(Y2) ; also sheet 2
A11: LAT10.P$13(Y3) ; also sheet 2
A12: LAT10.P$14(Y4) ; also sheet 2
A13: LAT10.P$15(Y5) ; also sheet 2
A14: LAT10.P$16(Y6) ; also sheet 2
A15: LAT10.P$17(Y7) ; also sheet 2
B0: LAT6.P$10(Y0) ; also sheet 2
B1: LAT6.P$11(Y1) ; also sheet 2
B2: LAT6.P$12(Y2) ; also sheet 2
B3: LAT6.P$13(Y3) ; also sheet 2
B4: LAT6.P$14(Y4) ; also sheet 2
B5: LAT6.P$15(Y5) ; also sheet 2
B6: LAT6.P$16(Y6) ; also sheet 2
B7: LAT6.P$17(Y7) ; also sheet 2
B8: LAT11.P$10(Y0) ; also sheet 2
B9: LAT11.P$11(Y1) ; also sheet 2
B10: LAT11.P$12(Y2) ; also sheet 2
B11: LAT11.P$13(Y3) ; also sheet 2
B12: LAT11.P$14(Y4) ; also sheet 2
B13: LAT11.P$15(Y5) ; also sheet 2
B14: LAT11.P$16(Y6) ; also sheet 2
B15: LAT11.P$17(Y7) ; also sheet 2
C0: LAT7.P$10(Y0) ; also sheet 2
C1: LAT7.P$11(Y1) ; also sheet 2
C2: LAT7.P$12(Y2) ; also sheet 2
C3: LAT7.P$13(Y3) ; also sheet 2
C4: LAT7.P$14(Y4) ; also sheet 2
C5: LAT7.P$15(Y5) ; also sheet 2
C6: LAT7.P$16(Y6) ; also sheet 2
C7: LAT7.P$17(Y7) ; also sheet 2
C8: LAT12.P$10(Y0) ; also sheet 2
C9: LAT12.P$11(Y1) ; also sheet 2
C10: LAT12.P$12(Y2) ; also sheet 2
C11: LAT12.P$13(Y3) ; also sheet 2
C12: LAT12.P$14(Y4) ; also sheet 2
C13: LAT12.P$15(Y5) ; also sheet 2
C14: LAT12.P$16(Y6) ; also sheet 2
C15: LAT12.P$17(Y7) ; also sheet 2
D0: LAT8.P$10(Y0) ; also sheet 2
D1: LAT8.P$11(Y1) ; also sheet 2
D2: LAT8.P$12(Y2) ; also sheet 2
D3: LAT8.P$13(Y3) ; also sheet 2
D4: LAT8.P$14(Y4) ; also sheet 2
D5: LAT8.P$15(Y5) ; also sheet 2
D6: LAT8.P$16(Y6) ; also sheet 2
D7: LAT8.P$17(Y7) ; also sheet 2
D8: LAT13.P$10(Y0) ; also sheet 2
D9: LAT13.P$11(Y1) ; also sheet 2
D10: LAT13.P$12(Y2) ; also sheet 2
D11: LAT13.P$13(Y3) ; also sheet 2
D12: LAT13.P$14(Y4) ; also sheet 2
D13: LAT13.P$15(Y5) ; also sheet 2
D14: LAT13.P$16(Y6) ; also sheet 2
D15: LAT13.P$17(Y7) ; also sheet 2
LOAD_REG_A: AND5.P$1(A) LAT5.P$9(LATCHED) ; also sheet 7
LOAD_REG_B: AND6.P$1(A) LAT6.P$9(LATCHED) ; also sheet 7
LOAD_REG_C: AND7.P$1(A) LAT7.P$9(LATCHED) ; also sheet 7
LOAD_REG_D: AND8.P$1(A) LAT8.P$9(LATCHED) ; also sheet 7
LOAD_REG_SP: LAT20.P$9(LATCHED) LAT21.P$9(LATCHED) ; also sheet 7
N$151: AND5.P$3(Y) LAT10.P$9(LATCHED)
N$152: AND6.P$3(Y) LAT11.P$9(LATCHED)
N$153: AND8.P$3(Y) LAT13.P$9(LATCHED)
N$154: AND7.P$3(Y) LAT12.P$9(LATCHED)
OP_16BIT: AND5.P$2(B) AND6.P$2(B) AND7.P$2(B) AND8.P$2(B) ; also sheet 3,4
SP0: LAT20.P$10(Y0) ; also sheet 2
SP1: LAT20.P$11(Y1) ; also sheet 2
SP2: LAT20.P$12(Y2) ; also sheet 2
SP3: LAT20.P$13(Y3) ; also sheet 2
SP4: LAT20.P$14(Y4) ; also sheet 2
SP5: LAT20.P$15(Y5) ; also sheet 2
SP6: LAT20.P$16(Y6) ; also sheet 2
SP7: LAT20.P$17(Y7) ; also sheet 2
SP8: LAT21.P$10(Y0) ; also sheet 2
SP9: LAT21.P$11(Y1) ; also sheet 2
SP10: LAT21.P$12(Y2) ; also sheet 2
SP11: LAT21.P$13(Y3) ; also sheet 2
SP12: LAT21.P$14(Y4) ; also sheet 2
SP13: LAT21.P$15(Y5) ; also sheet 2
SP14: LAT21.P$16(Y6) ; also sheet 2
SP15: LAT21.P$17(Y7) ; also sheet 2
Z0: LAT5.P$1(A0) LAT6.P$1(A0) LAT7.P$1(A0) LAT8.P$1(A0) LAT20.P$1(A0) ; also sheet 1,2,3,9,10
Z1: LAT5.P$2(A1) LAT6.P$2(A1) LAT7.P$2(A1) LAT8.P$2(A1) LAT20.P$2(A1) ; also sheet 1,2,3,9,10
Z2: LAT5.P$3(A2) LAT6.P$3(A2) LAT7.P$3(A2) LAT8.P$3(A2) LAT20.P$3(A2) ; also sheet 1,2,3,9,10
Z3: LAT5.P$4(A3) LAT6.P$4(A3) LAT7.P$4(A3) LAT8.P$4(A3) LAT20.P$4(A3) ; also sheet 1,2,3,9,10
Z4: LAT5.P$5(A4) LAT6.P$5(A4) LAT7.P$5(A4) LAT8.P$5(A4) LAT20.P$5(A4) ; also sheet 1,2,3,9,10
Z5: LAT5.P$6(A5) LAT6.P$6(A5) LAT7.P$6(A5) LAT8.P$6(A5) LAT20.P$6(A5) ; also sheet 1,2,3,9,10
Z6: LAT5.P$7(A6) LAT6.P$7(A6) LAT7.P$7(A6) LAT8.P$7(A6) LAT20.P$7(A6) ; also sheet 1,2,3,9,10
Z7: LAT5.P$8(A7) LAT6.P$8(A7) LAT7.P$8(A7) LAT8.P$8(A7) LAT20.P$8(A7) ; also sheet 1,2,3,9,10
Z8: LAT10.P$1(A0) LAT11.P$1(A0) LAT12.P$1(A0) LAT13.P$1(A0) LAT21.P$1(A0) ; also sheet 1,2,3,9
Z9: LAT10.P$2(A1) LAT11.P$2(A1) LAT12.P$2(A1) LAT13.P$2(A1) LAT21.P$2(A1) ; also sheet 1,2,3,9
Z10: LAT10.P$3(A2) LAT11.P$3(A2) LAT12.P$3(A2) LAT13.P$3(A2) LAT21.P$3(A2) ; also sheet 1,2,3,9
Z11: LAT10.P$4(A3) LAT11.P$4(A3) LAT12.P$4(A3) LAT13.P$4(A3) LAT21.P$4(A3) ; also sheet 1,2,3,9
Z12: LAT10.P$5(A4) LAT11.P$5(A4) LAT12.P$5(A4) LAT13.P$5(A4) LAT21.P$5(A4) ; also sheet 1,2,3,9
Z13: LAT10.P$6(A5) LAT11.P$6(A5) LAT12.P$6(A5) LAT13.P$6(A5) LAT21.P$6(A5) ; also sheet 1,2,3,9
Z14: LAT10.P$7(A6) LAT11.P$7(A6) LAT12.P$7(A6) LAT13.P$7(A6) LAT21.P$7(A6) ; also sheet 1,2,3,9
Z15: LAT10.P$8(A7) LAT11.P$8(A7) LAT12.P$8(A7) LAT13.P$8(A7) LAT21.P$8(A7) ; also sheet 1,2,3,9

### Buses
A[0..15]
B[0..15]
C[0..15]
D[0..15]
Z[0..15]
SP[0..15]

### Notes on the sheet
- Registers

## Sheet 7 of 10: Microcode Decode
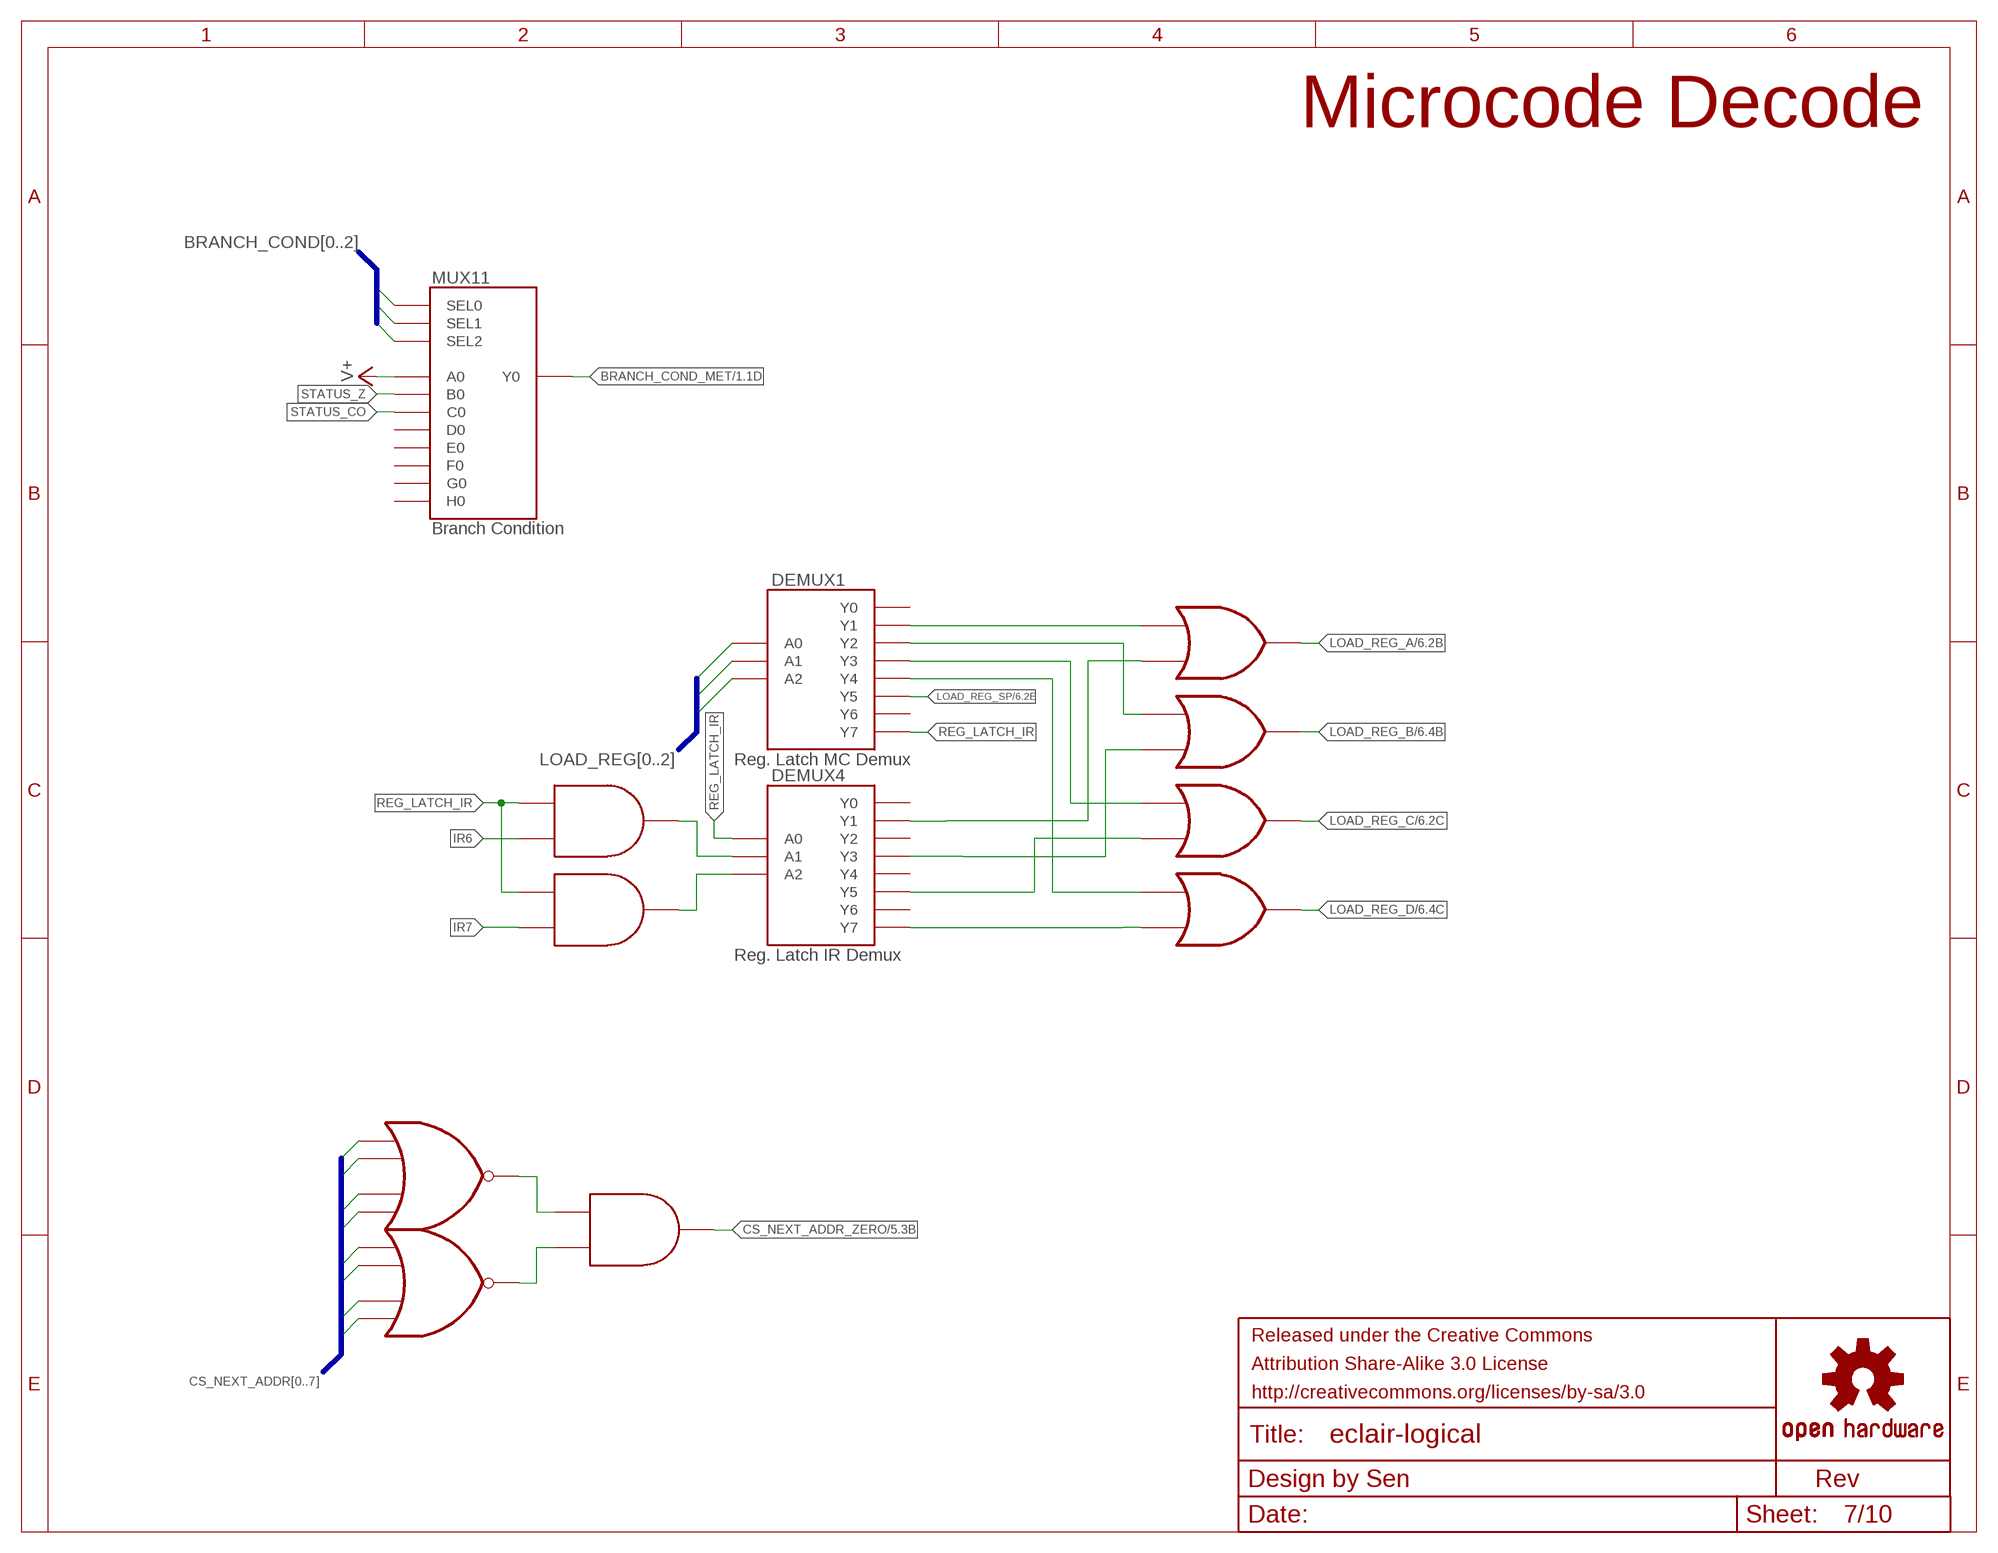
[diagram p6: schematic, sheet 7]

### Parts
AND2  AND-2  [NULL]
AND4  AND-2  [NULL]
AND9  AND-2  [NULL]
DEMUX1  Reg. Latch MC Demux  DEMUX-3X8  [NULL]
DEMUX4  Reg. Latch IR Demux  DEMUX-3X8  [NULL]
FRAME6  FRAME-LETTER-GRID-OSHW-SEN  [CC-BY-SA-3.0-LARGE]
MUX11  Branch Condition  MUX-8X1  [NULL]
NOR4  NOR-4  [NULL]
NOR5  NOR-4  [NULL]
OR1  OR-2  [NULL]
OR2  OR-2  [NULL]
OR3  OR-2  [NULL]
OR4  OR-2  [NULL]

### Nets
BRANCH_COND0: MUX11.P$9(SEL0) ; also sheet 4
BRANCH_COND1: MUX11.P$10(SEL1) ; also sheet 4
BRANCH_COND2: MUX11.P$11(SEL2) ; also sheet 4
BRANCH_COND_MET: MUX11.P$12(Y0) ; also sheet 1
CS_NEXT_ADDR0: NOR4.P$1(A) ; also sheet 4,5
CS_NEXT_ADDR1: NOR4.P$2(B) ; also sheet 4,5
CS_NEXT_ADDR2: NOR4.P$3(C) ; also sheet 4,5
CS_NEXT_ADDR3: NOR4.P$4(D) ; also sheet 4,5
CS_NEXT_ADDR4: NOR5.P$1(A) ; also sheet 4,5
CS_NEXT_ADDR5: NOR5.P$2(B) ; also sheet 4,5
CS_NEXT_ADDR6: NOR5.P$3(C) ; also sheet 4,5
CS_NEXT_ADDR7: NOR5.P$4(D) ; also sheet 4,5
CS_NEXT_ADDR_ZERO: AND9.P$3(Y) ; also sheet 5
IR6: AND2.P$2(B) ; also sheet 5
IR7: AND4.P$2(B) ; also sheet 5
LOAD_REG0: DEMUX1.P$1(A0) ; also sheet 4
LOAD_REG1: DEMUX1.P$2(A1) ; also sheet 4
LOAD_REG2: DEMUX1.P$3(A2) ; also sheet 4
LOAD_REG_A: OR1.P$3(Y) ; also sheet 6
LOAD_REG_B: OR2.P$3(Y) ; also sheet 6
LOAD_REG_C: OR3.P$3(Y) ; also sheet 6
LOAD_REG_D: OR4.P$3(Y) ; also sheet 6
LOAD_REG_SP: DEMUX1.P$9(Y5) ; also sheet 6
N$10: DEMUX4.P$11(Y7) OR4.P$2(B)
N$25: AND2.P$3(Y) DEMUX4.P$2(A1)
N$26: AND4.P$3(Y) DEMUX4.P$3(A2)
N$28: DEMUX4.P$9(Y5) OR3.P$2(B)
N$29: DEMUX4.P$7(Y3) OR2.P$2(B)
N$30: DEMUX4.P$5(Y1) OR1.P$2(B)
N$31: DEMUX1.P$5(Y1) OR1.P$1(A)
N$32: DEMUX1.P$6(Y2) OR2.P$1(A)
N$149: DEMUX1.P$7(Y3) OR3.P$1(A)
N$150: DEMUX1.P$8(Y4) OR4.P$1(A)
N$155: AND9.P$1(A) NOR4.P$5(Y)
N$158: AND9.P$2(B) NOR5.P$5(Y)
REG_LATCH_IR: AND2.P$1(A) AND4.P$1(A) DEMUX1.P$11(Y7) DEMUX4.P$1(A0)
STATUS_CO: MUX11.P$3(C0) ; also sheet 3
STATUS_Z: MUX11.P$2(B0) ; also sheet 3
V+: MUX11.P$1(A0) ; also sheet 1,4,5,10
Unconnected: DEMUX1.P$4(Y0) DEMUX1.P$10(Y6) DEMUX4.P$4(Y0) DEMUX4.P$6(Y2) DEMUX4.P$8(Y4) DEMUX4.P$10(Y6) MUX11.P$4(D0) MUX11.P$5(E0) MUX11.P$6(F0) MUX11.P$7(G0) MUX11.P$8(H0)

### Buses
LOAD_REG[0..2]
CS_NEXT_ADDR[0..7]
BRANCH_COND[0..2]

### Notes on the sheet
- Microcode Decode

## Sheet 8 of 10: Memory
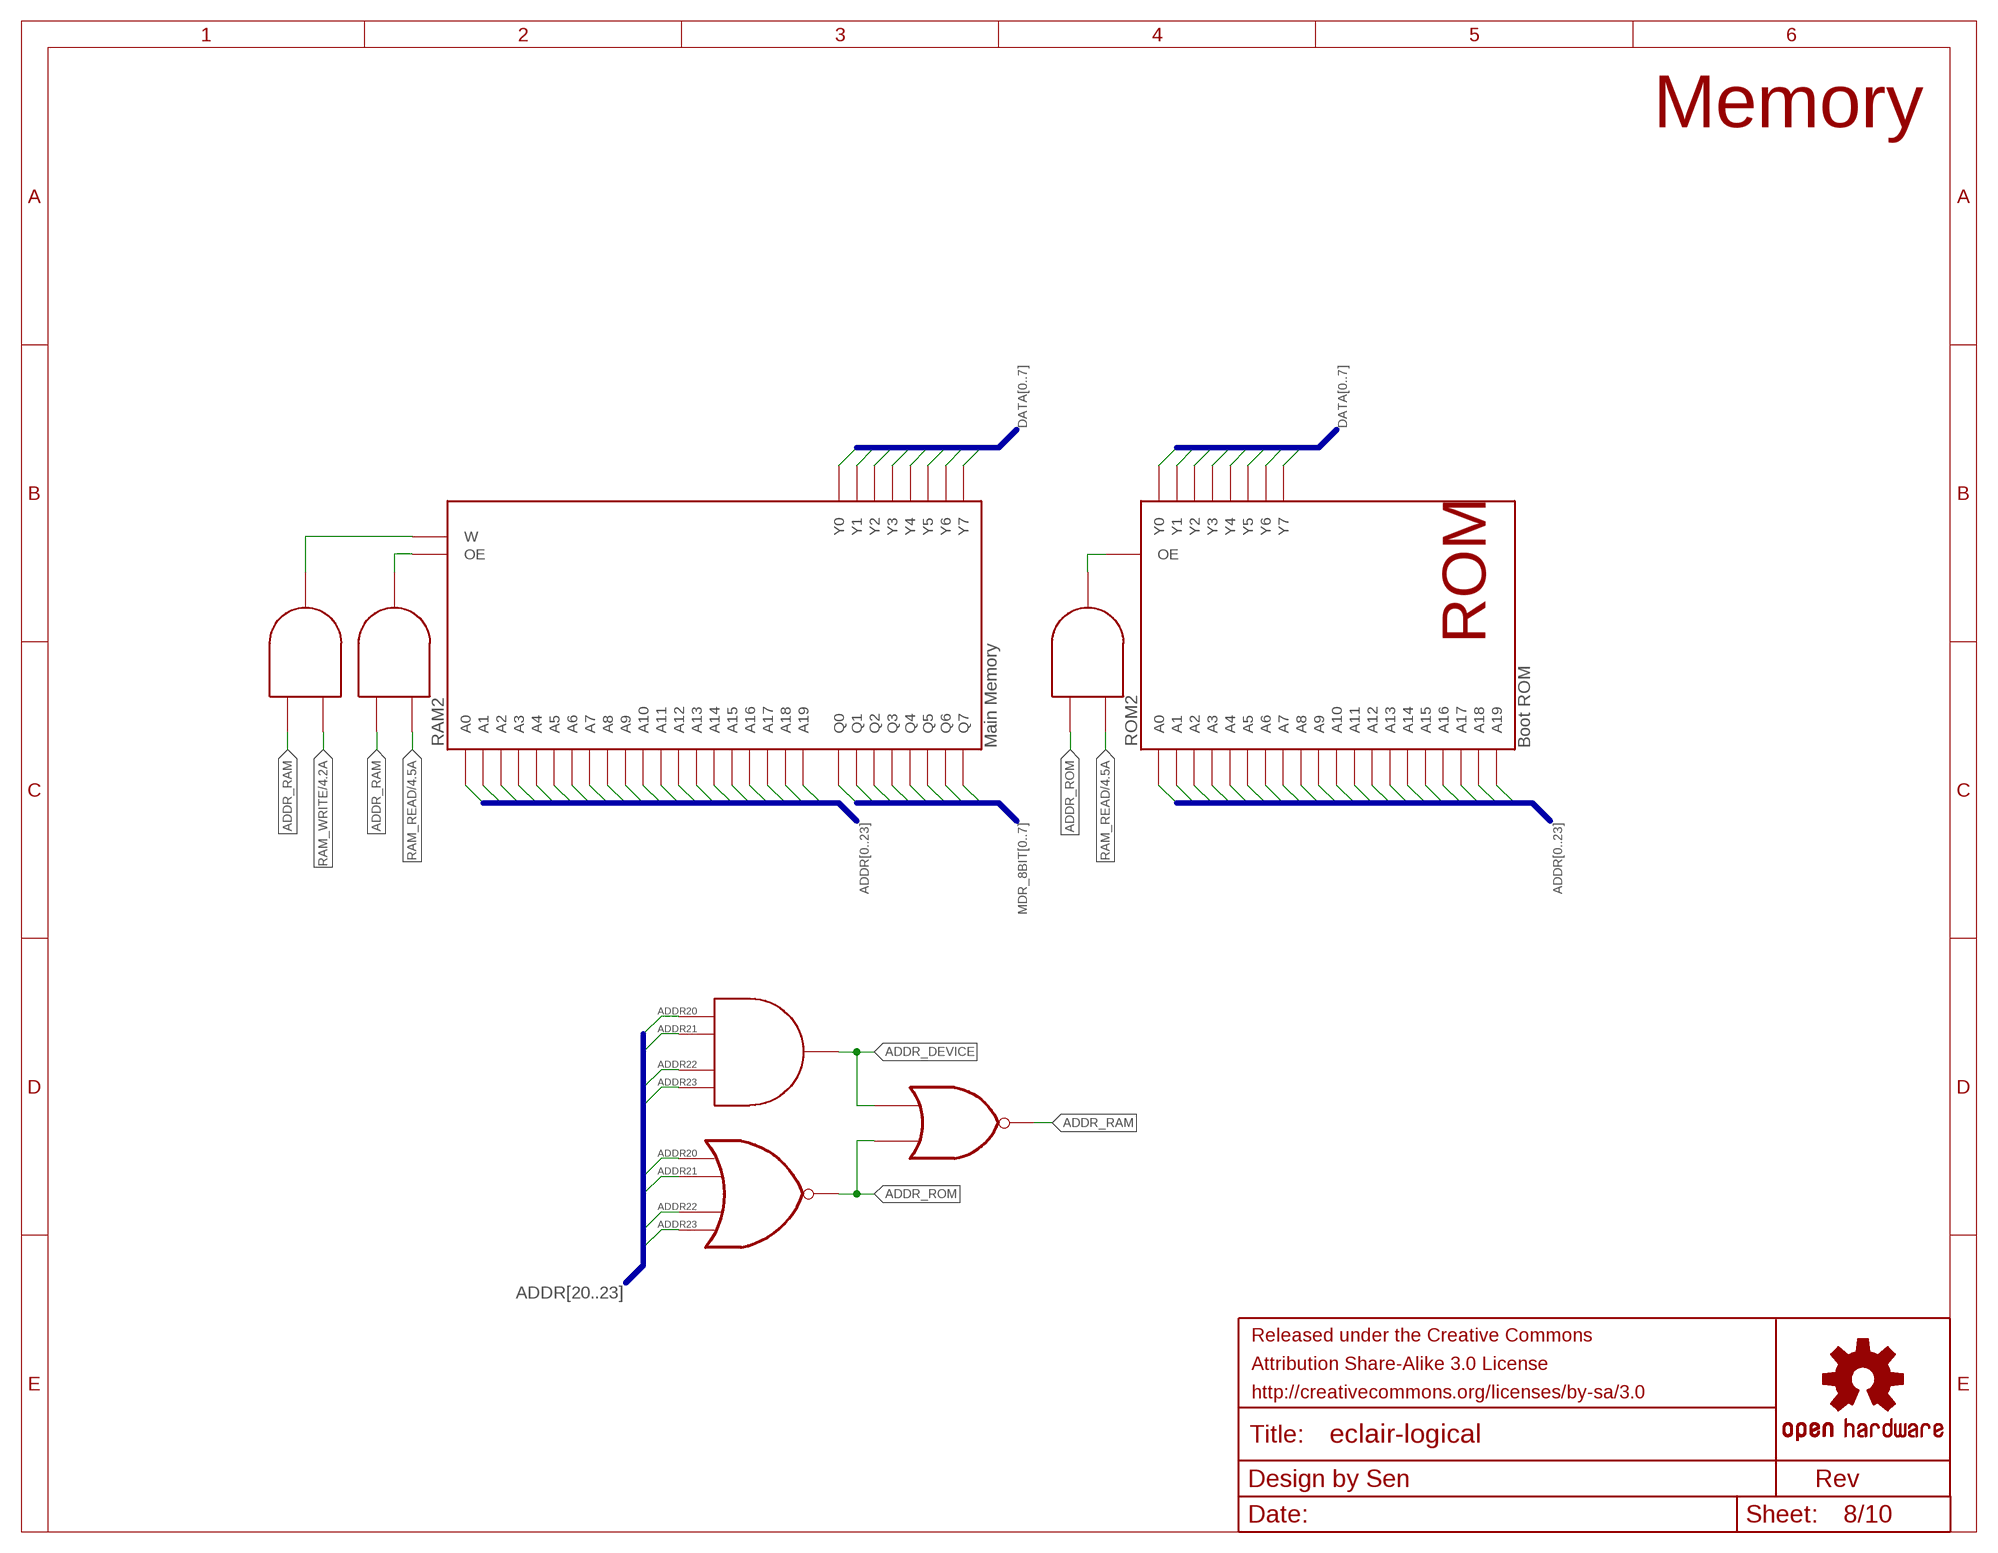
[diagram p7: schematic, sheet 8]

### Parts
AND1  AND-4  [NULL]
AND3  AND-2  [NULL]
AND23  AND-2  [NULL]
AND24  AND-2  [NULL]
FRAME7  FRAME-LETTER-GRID-OSHW-SEN  [CC-BY-SA-3.0-LARGE]
NOR2  NOR-2  [NULL]
NOR3  NOR-4  [NULL]
RAM2  Main Memory  RAM-A20D8  [NULL]
ROM2  Boot ROM  ROM-A20D8  [NULL]

### Nets
ADDR0: RAM2.P$1(A0) ROM2.P$1(A0) ; also sheet 9
ADDR1: RAM2.P$2(A1) ROM2.P$2(A1) ; also sheet 9
ADDR2: RAM2.P$3(A2) ROM2.P$3(A2) ; also sheet 9
ADDR3: RAM2.P$4(A3) ROM2.P$4(A3) ; also sheet 9
ADDR4: RAM2.P$5(A4) ROM2.P$5(A4) ; also sheet 9
ADDR5: RAM2.P$6(A5) ROM2.P$6(A5) ; also sheet 9
ADDR6: RAM2.P$7(A6) ROM2.P$7(A6) ; also sheet 9
ADDR7: RAM2.P$8(A7) ROM2.P$8(A7) ; also sheet 9
ADDR8: RAM2.P$9(A8) ROM2.P$9(A8) ; also sheet 9
ADDR9: RAM2.P$10(A9) ROM2.P$10(A9) ; also sheet 9
ADDR10: RAM2.P$11(A10) ROM2.P$11(A10) ; also sheet 9
ADDR11: RAM2.P$12(A11) ROM2.P$12(A11) ; also sheet 9
ADDR12: RAM2.P$13(A12) ROM2.P$13(A12) ; also sheet 9
ADDR13: RAM2.P$14(A13) ROM2.P$14(A13) ; also sheet 9
ADDR14: ROM2.P$15(A14) ; also sheet 9
ADDR15: RAM2.P$15(A14) RAM2.P$16(A15) ROM2.P$16(A15) ; also sheet 9
ADDR16: RAM2.P$17(A16) ROM2.P$17(A16) ; also sheet 9
ADDR17: RAM2.P$18(A17) ROM2.P$18(A17) ; also sheet 9
ADDR18: RAM2.P$19(A18) ROM2.P$19(A18) ; also sheet 9
ADDR19: RAM2.P$20(A19) ROM2.P$20(A19) ; also sheet 9
ADDR20: AND1.P$1(A) NOR3.P$1(A) ; also sheet 9
ADDR21: AND1.P$2(B) NOR3.P$2(B) ; also sheet 9
ADDR22: AND1.P$3(C) NOR3.P$3(C) ; also sheet 9
ADDR23: AND1.P$4(D) NOR3.P$4(D) ; also sheet 9
ADDR_DEVICE: AND1.P$5(Y) NOR2.P$1(A)
ADDR_RAM: AND23.P$1(A) AND24.P$1(A) NOR2.P$3(Y)
ADDR_ROM: AND3.P$1(A) NOR2.P$2(B) NOR3.P$5(Y)
DATA0: RAM2.P$31(Y0) ROM2.P$22(Y0) ; also sheet 1,5
DATA1: RAM2.P$32(Y1) ROM2.P$23(Y1) ; also sheet 1,5
DATA2: RAM2.P$33(Y2) ROM2.P$24(Y2) ; also sheet 1,5
DATA3: RAM2.P$34(Y3) ROM2.P$25(Y3) ; also sheet 1,5
DATA4: RAM2.P$35(Y4) ROM2.P$26(Y4) ; also sheet 1,5
DATA5: RAM2.P$36(Y5) ROM2.P$27(Y5) ; also sheet 1,5
DATA6: RAM2.P$37(Y6) ROM2.P$28(Y6) ; also sheet 1,5
DATA7: RAM2.P$38(Y7) ROM2.P$29(Y7) ; also sheet 1,5
MDR_8BIT0: RAM2.P$22(Q0) ; also sheet 1
MDR_8BIT1: RAM2.P$23(Q1) ; also sheet 1
MDR_8BIT2: RAM2.P$24(Q2) ; also sheet 1
MDR_8BIT3: RAM2.P$25(Q3) ; also sheet 1
MDR_8BIT4: RAM2.P$26(Q4) ; also sheet 1
MDR_8BIT5: RAM2.P$27(Q5) ; also sheet 1
MDR_8BIT6: RAM2.P$28(Q6) ; also sheet 1
MDR_8BIT7: RAM2.P$29(Q7) ; also sheet 1
N$11: AND23.P$3(Y) RAM2.P$21(OE)
N$97: AND3.P$3(Y) ROM2.P$21(OE)
N$173: AND24.P$3(Y) RAM2.P$30(W)
RAM_READ: AND3.P$2(B) AND23.P$2(B) ; also sheet 4
RAM_WRITE: AND24.P$2(B) ; also sheet 4

### Buses
DATA[0..7]
ADDR[0..23]
ADDR[20..23]
MDR_8BIT[0..7]

### Notes on the sheet
- Memory